# Altium project RK3568-SOM.PrjPcb (part 1 of 3)
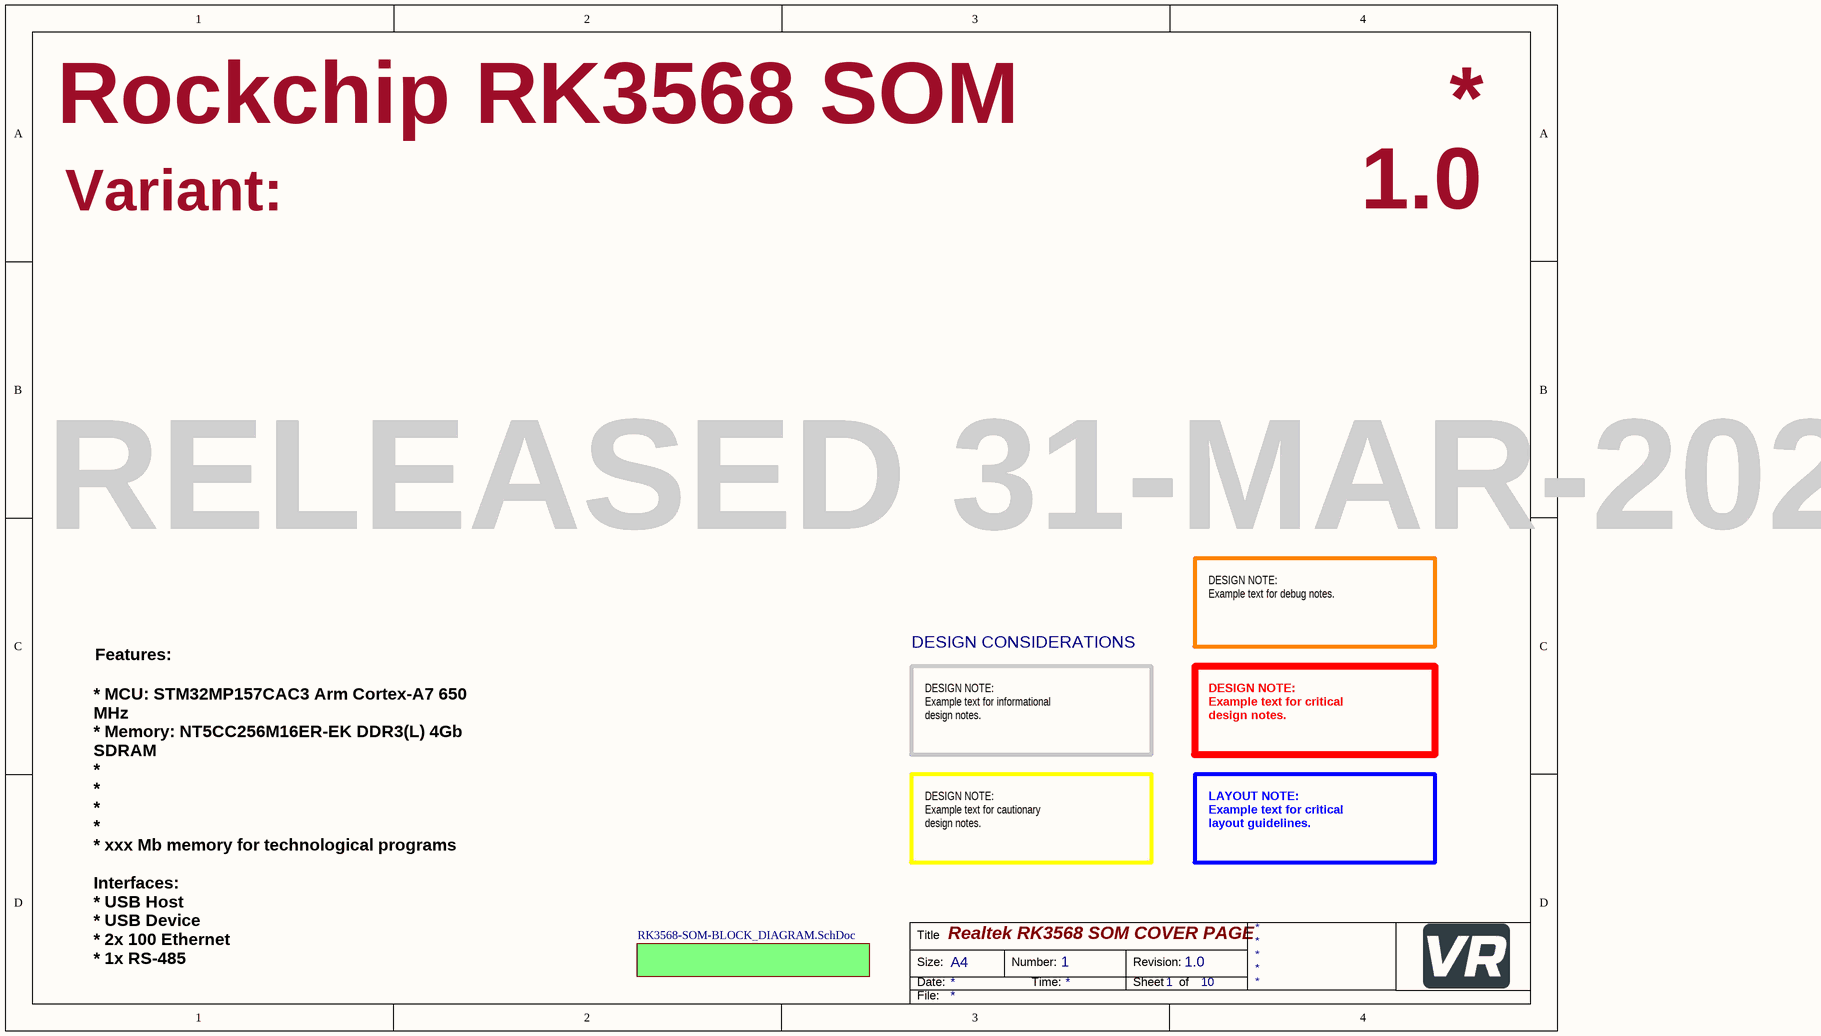
[diagram p0: RK3568-SOM-COVER.SchDoc]
Project: Rockchip RK3568 SOM; VersionRevision: 1.0
7 sheets, 489 parts. Net scope: flat (ports and power ports of the same name join across sheets).
Board file: RK3568-SOM-Board.PcbDoc
Sheets:
  RK3568-SOM-COVER.SchDoc
    Designator = RK3568-SOM-BLOCK_DIAGRAM.SchDoc
      Ethernet = RK3568-SOM-Eth.SchDoc
      Power = RK3568-SOM-PWR.SchDoc
      Memory = RK3568-SOM-DDR3_MEM.SchDoc
      EDGE CONNECTOR = RK3568-SOM-EDGE_CONNECTOR.SchDoc
      MCU = RK3568-SOM-MCU.SchDoc
      USB = RK3568-SOM-Eth.SchDoc

## Sheet RK3568-SOM-COVER.SchDoc: Realtek RK3568 SOM COVER PAGE
size A4; Author: Vladimir Tyrkin; CompanyName: VR; DocumentNumber: 1; Revision: 1.0; SheetNumber: 1; SheetTotal: 10

### Sub-sheets
Designator = RK3568-SOM-BLOCK_DIAGRAM.SchDoc: no entries

### Notes on the sheet
- Variant:
- RELEASED 31-MAR-2023
- DESIGN CONSIDERATIONS
- DESIGN NOTE:
  Example text for debug notes.
- Features:
- DESIGN NOTE:
  Example text for informational
  design notes.
- DESIGN NOTE:
  Example text for critical
  design notes.
- DESIGN NOTE:
  Example text for cautionary
  design notes.
- LAYOUT NOTE:
  Example text for critical
  layout guidelines.
- * MCU: STM32MP157CAC3 Arm Cortex-A7 650 MHz
  * Memory: NT5CC256M16ER-EK DDR3(L) 4Gb SDRAM
  *
  *
  *
  *
  * xxx Mb memory for technological programs
  Interfaces:
  * USB Host
  * USB Device
  * 2x 100 Ethernet
  * 1x RS-485
- Title
- Size:
- Date:
- A4
- Number:
- Time:
- Revision:
- Sheet
- of
- File:

## Sheet RK3568-SOM-BLOCK_DIAGRAM.SchDoc
size A1; DocumentNumber: 2; SheetNumber: 2; SheetTotal: 31; PageSetup: Record=PageOptions|CenterHorizontal=True|CenterVertical=True|PrintScale=0.52|XCorrection=1.00|YCorrection=1.00|PrintKind=1|BorderSize=5000000|LeftOffset=0|BottomOffset=0|Orientation=2|PaperLength=1000|PaperWidth=1000|Scale=100|PaperSource=4|PrintQuality=600|MediaType=1|DitherType=10|PrintScaleMode=1|PaperKind=A4|PaperIndex=9
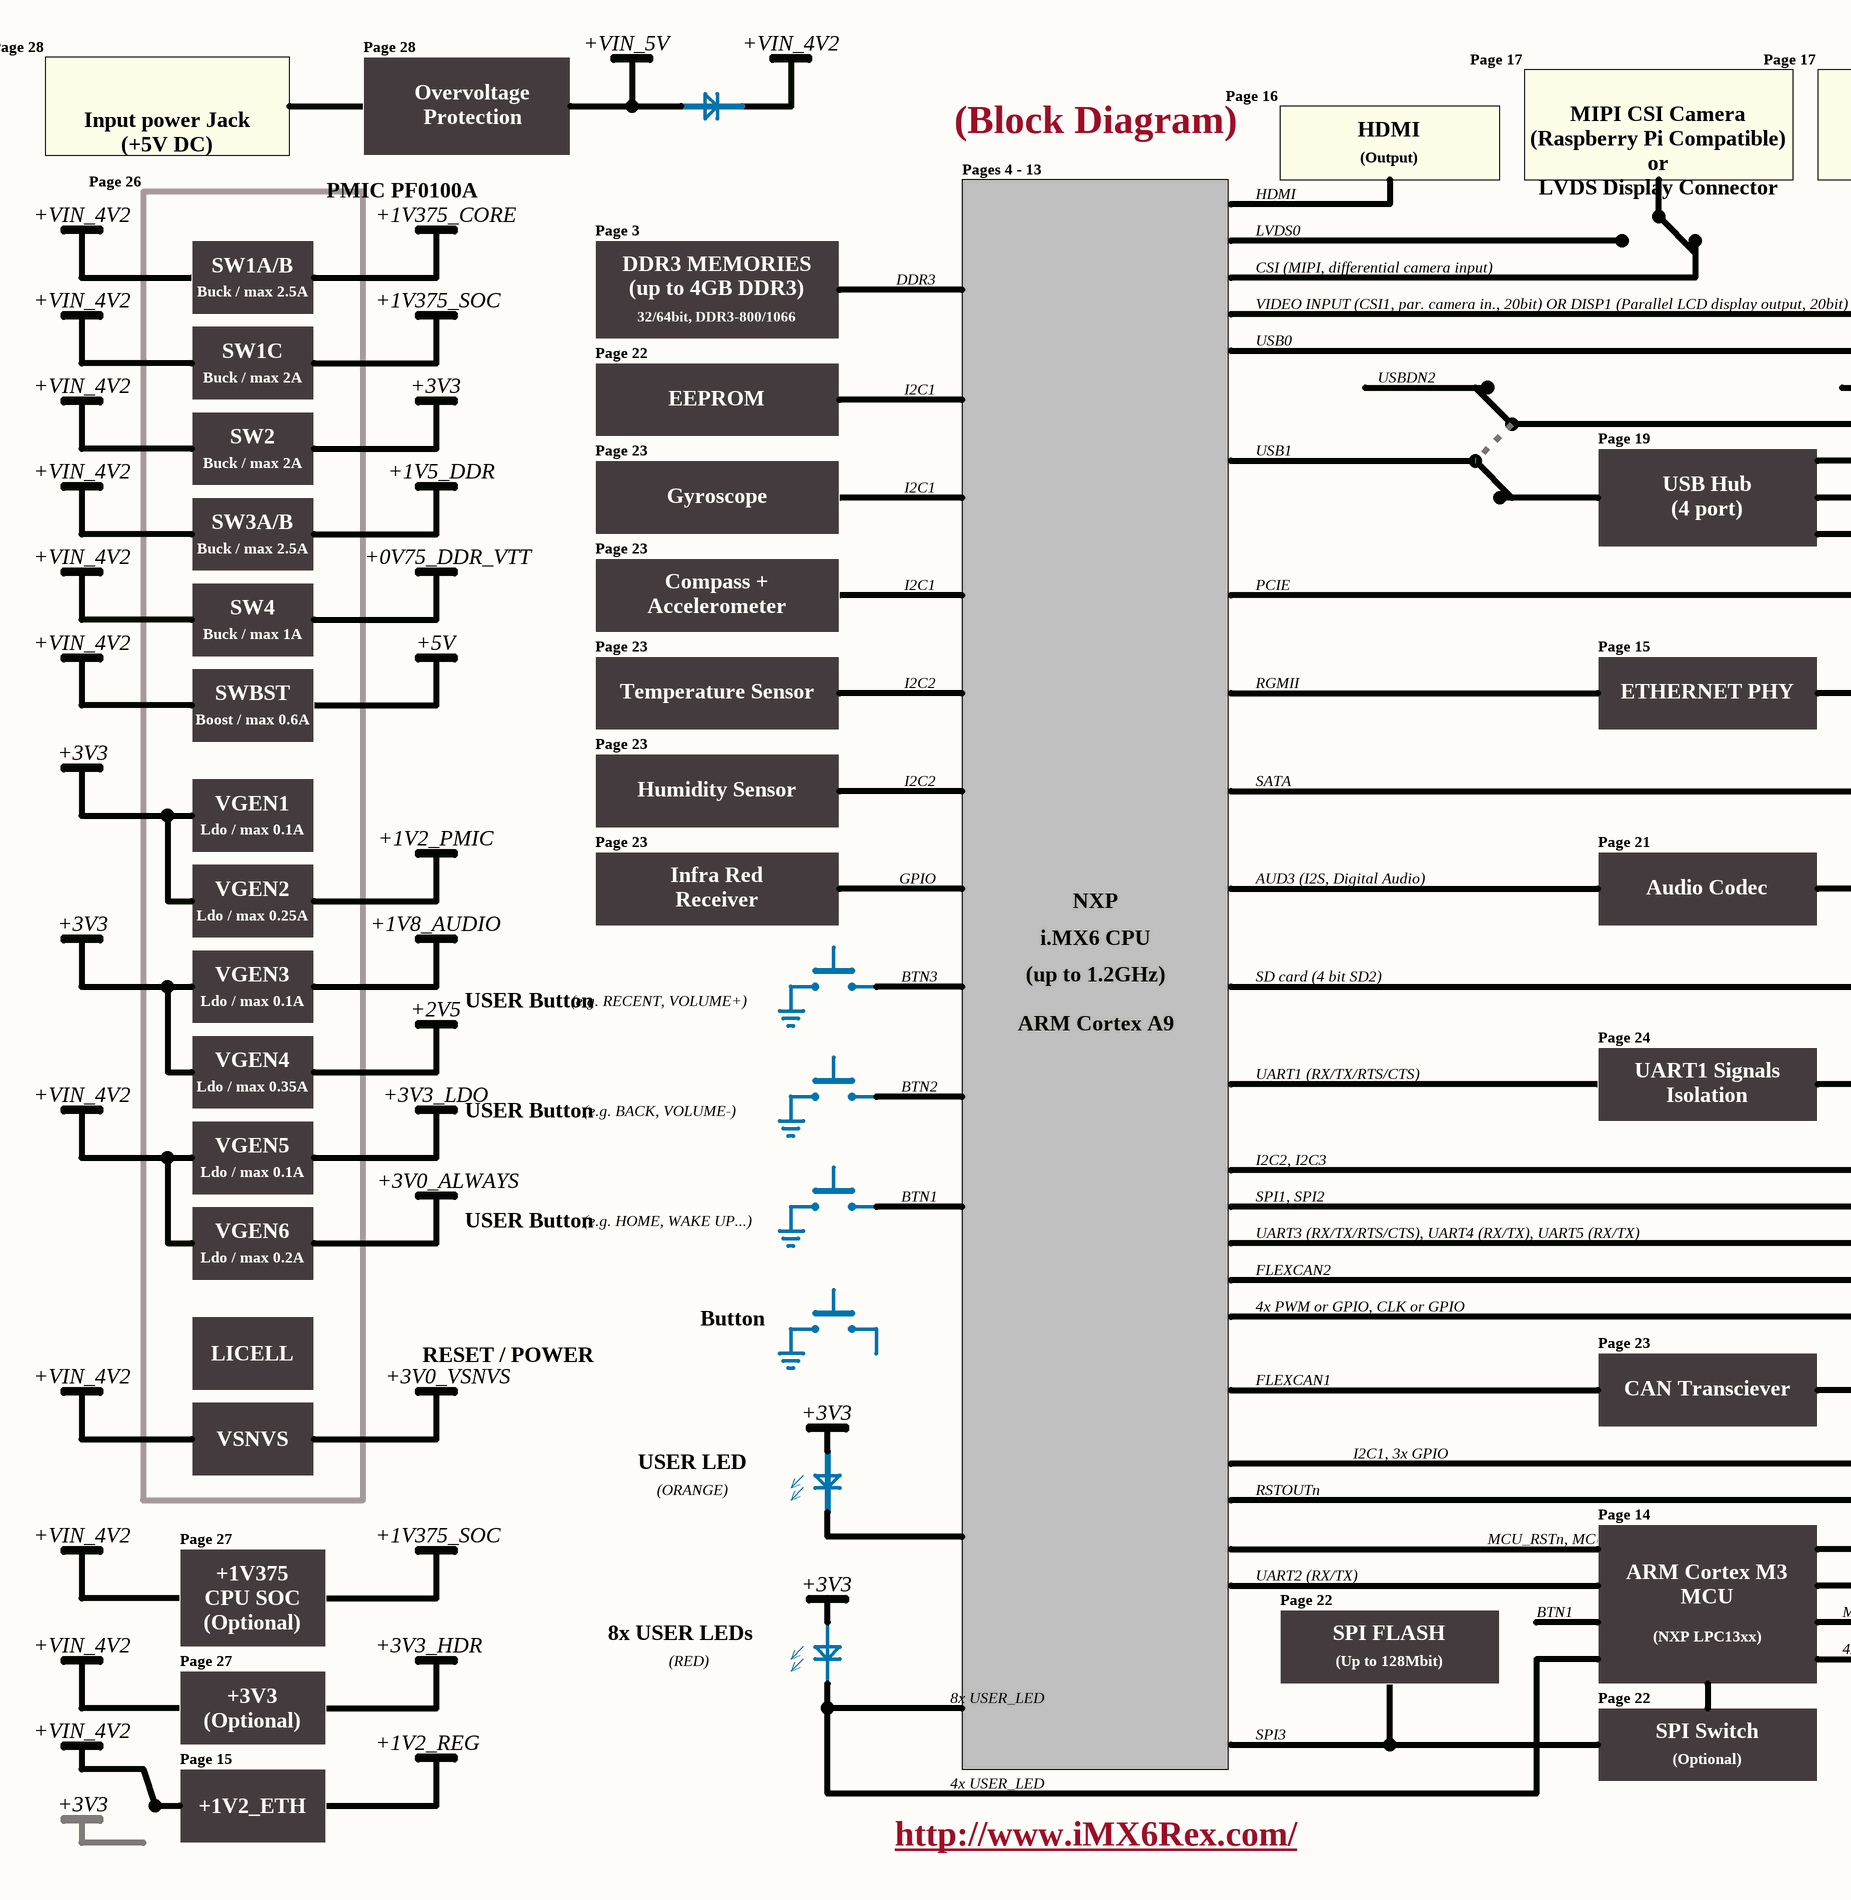
[diagram p1: RK3568-SOM-BLOCK_DIAGRAM.SchDoc, left]
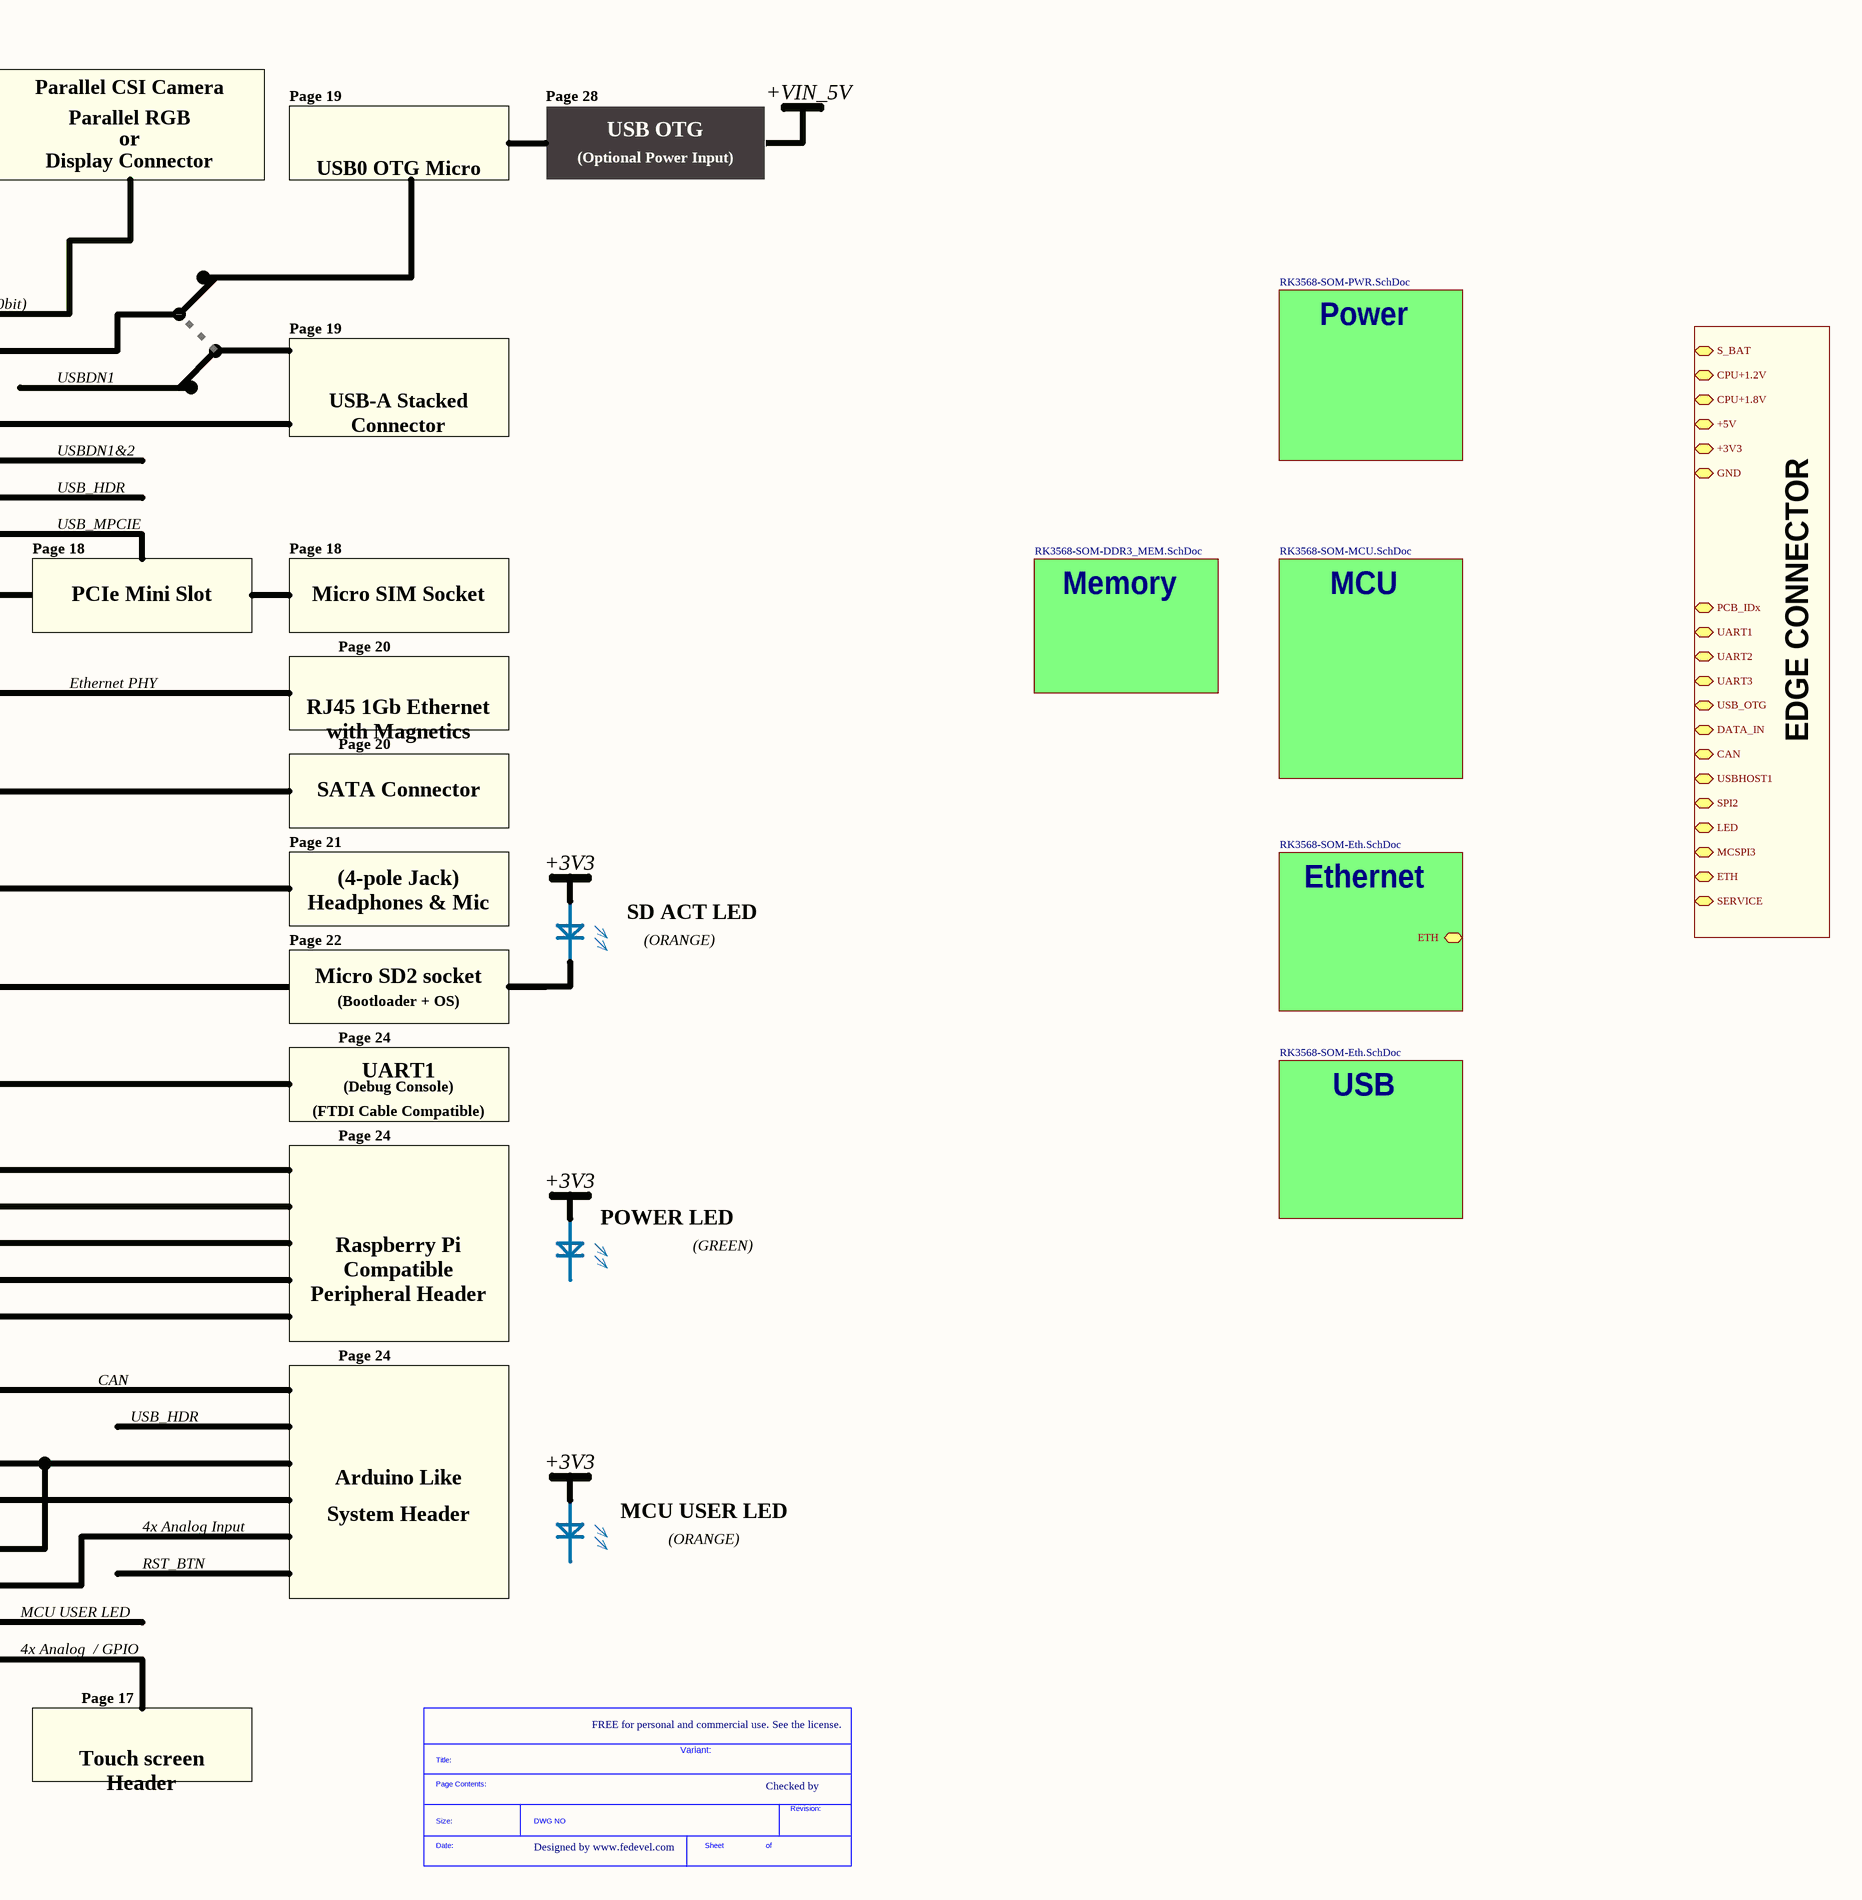
[diagram p2: RK3568-SOM-BLOCK_DIAGRAM.SchDoc, right]

### Parts
(Parts that share a designator on the sheet are numbered #1, #2 ... from top to bottom, then left to right.)
*#1  SDTitleBlock  (value not drawn)  (graphical)

### Sub-sheets
EDGE CONNECTOR = RK3568-SOM-EDGE_CONNECTOR.SchDoc: S_BAT (bidir), CPU+1.2V (bidir), GND (bidir), PCB_IDx (bidir, harness PCB_IDx), UART1 (bidir, harness UART1), UART2 (bidir, harness UART2), UART3 (bidir, harness UART3), USB_OTG (bidir, harness USB_OTG), DATA_IN (bidir, harness DATA_IN), CAN (bidir, harness CAN), USBHOST1 (bidir, harness USBHOST1), SPI2 (bidir, harness SPI2), LED (bidir, harness LED), MCSPI3 (bidir, harness MCSPI3), ETH (bidir, harness ETH), SERVICE (bidir, harness SERVICE), CPU+1.8V (bidir), +5V (bidir), +3V3 (bidir)
Ethernet = RK3568-SOM-Eth.SchDoc: ETH (bidir, harness ETH)
MCU = RK3568-SOM-MCU.SchDoc: no entries
Memory = RK3568-SOM-DDR3_MEM.SchDoc: no entries
Power = RK3568-SOM-PWR.SchDoc: no entries
USB = RK3568-SOM-Eth.SchDoc: no entries

### Notes on the sheet
- Page 28
- +VIN_5V
- +VIN_4V2
- Page 17
- MIPI CSI Camera
- Parallel CSI Camera
- Input power Jack
- (+5V DC)
- Overvoltage
- Protection
- (Block Diagram)
- Page 16
- HDMI
- (Raspberry Pi Compatible)
- or
- Parallel RGB
- Page 19
- USB0 OTG Micro
- USB OTG
- Page 26
- PMIC PF0100A
- Pages 4 - 13
- (Output)
- LVDS Display Connector
- Display Connector
- (Optional Power Input)
- SW1A/B
- +1V375_CORE
- Page 3
- DDR3 MEMORIES
- LVDS0
- CSI (MIPI, differential camera input)
- Buck / max 2.5A
- +1V375_SOC
- 32/64bit, DDR3-800/1066
- (up to 4GB DDR3)
- DDR3
- VIDEO INPUT (CSI1, par. camera in., 20bit) OR DISP1 (Parallel LCD display output, 20bit)
- SW1C
- Buck / max 2A
- +3V3
- Page 22
- I2C1
- USB0
- USBDN2
- USBDN1
- USB-A Stacked
- SW2
- Page 23
- EEPROM
- USB1
- USBDN1&2
- Connector
- SW3A/B
- +1V5_DDR
- Gyroscope
- USB Hub
- (4 port)
- USB_HDR
- +0V75_DDR_VTT
- Page 18
- USB_MPCIE
- SW4
- Buck / max 1A
- Compass +
- Accelerometer
- PCIE
- PCIe Mini Slot
- Micro SIM Socket
- SWBST
- +5V
- Temperature Sensor
- I2C2
- RGMII
- Page 15
- ETHERNET PHY
- Ethernet PHY
- Page 20
- RJ45 1Gb Ethernet
- Boost / max 0.6A
- with Magnetics
- VGEN1
- Humidity Sensor
- SATA
- SATA Connector
- Ldo / max 0.1A
- VGEN2
- +1V2_PMIC
- Infra Red
- GPIO
- AUD3 (I2S, Digital Audio)
- Page 21
- Headphones & Mic
- (4-pole Jack)
- Ldo / max 0.25A
- +1V8_AUDIO
- Receiver
- NXP
- i.MX6 CPU
- Audio Codec
- (ORANGE)
- SD ACT LED
- VGEN3
- (e.g. RECENT, VOLUME+)
- USER Button
- BTN3
- (up to 1.2GHz)
- SD card (4 bit SD2)
- Micro SD2 socket
- (Bootloader + OS)
- VGEN4
- +2V5
- ARM Cortex A9
- Page 24
- Ldo / max 0.35A
- +3V3_LDO
- (e.g. BACK, VOLUME-)
- BTN2
- UART1 (RX/TX/RTS/CTS)
- UART1 Signals
- Isolation
- UART1
- (Debug Console)
- (FTDI Cable Compatible)
- VGEN5
- +3V0_ALWAYS
- I2C2, I2C3
- VGEN6
- (e.g. HOME, WAKE UP...)
- BTN1
- SPI1, SPI2
- UART3 (RX/TX/RTS/CTS), UART4 (RX/TX), UART5 (RX/TX)
- Raspberry Pi
- Compatible
- POWER LED
- (GREEN)
- Ldo / max 0.2A
- Button
- 4x PWM or GPIO, CLK or GPIO
- FLEXCAN2
- Peripheral Header
- LICELL
- RESET / POWER
- VSNVS
- +3V0_VSNVS
- FLEXCAN1
- CAN Transciever
- CAN
- USER LED
- RSTOUTn
- I2C1, 3x GPIO
- System Header
- Arduino Like
- Page 27
- MCU_RSTn, MCU_ISPn, SWD debug
- Page 14
- 4x Analog Input
- MCU USER LED
- +1V375
- CPU SOC
- (Optional)
- UART2 (RX/TX)
- ARM Cortex M3
- MCU
- RST_BTN
- +3V3_HDR
- (RED)
- 8x USER LEDs
- SPI FLASH
- (Up to 128Mbit)
- (NXP LPC13xx)
- 4x Analog  / GPIO
- 8x USER_LED
- SPI3
- SPI Switch
- Touch screen
- FREE for personal and commercial use. See the license.
- +1V2_ETH
- +1V2_REG
- 4x USER_LED
- Header
- Variant:
- Checked by
- http://www.iMX6Rex.com/
- Designed by www.fedevel.com
- (in symbol SDTitleBlock) Title:; Page Contents:; Revision:; Size:; DWG NO; Date:; Sheet; of

## Sheet RK3568-SOM-Eth.SchDoc: Ethernet PHY with RJ45 connector
size A2; Date: Not used; ApprovedBy: Not used; CheckedBy: Not used; Author: Not used; CompanyName: STMicroelectronics; DrawnBy: Not used; Engineer: Not used; Organization: Not used; Address1: Not used; Address2: Not used; Address3: Not used; Address4: Not used; DocumentNumber: 6; Revision: Not used; SheetNumber: 6; SheetTotal: 9; Time: Not used; ImagePath: Not used; Application_BuildNumber: Not used
Used 2 times, as channels Designator/Ethernet, Designator/USB. Parts and nets are listed once, with the designators drawn on the sheet.
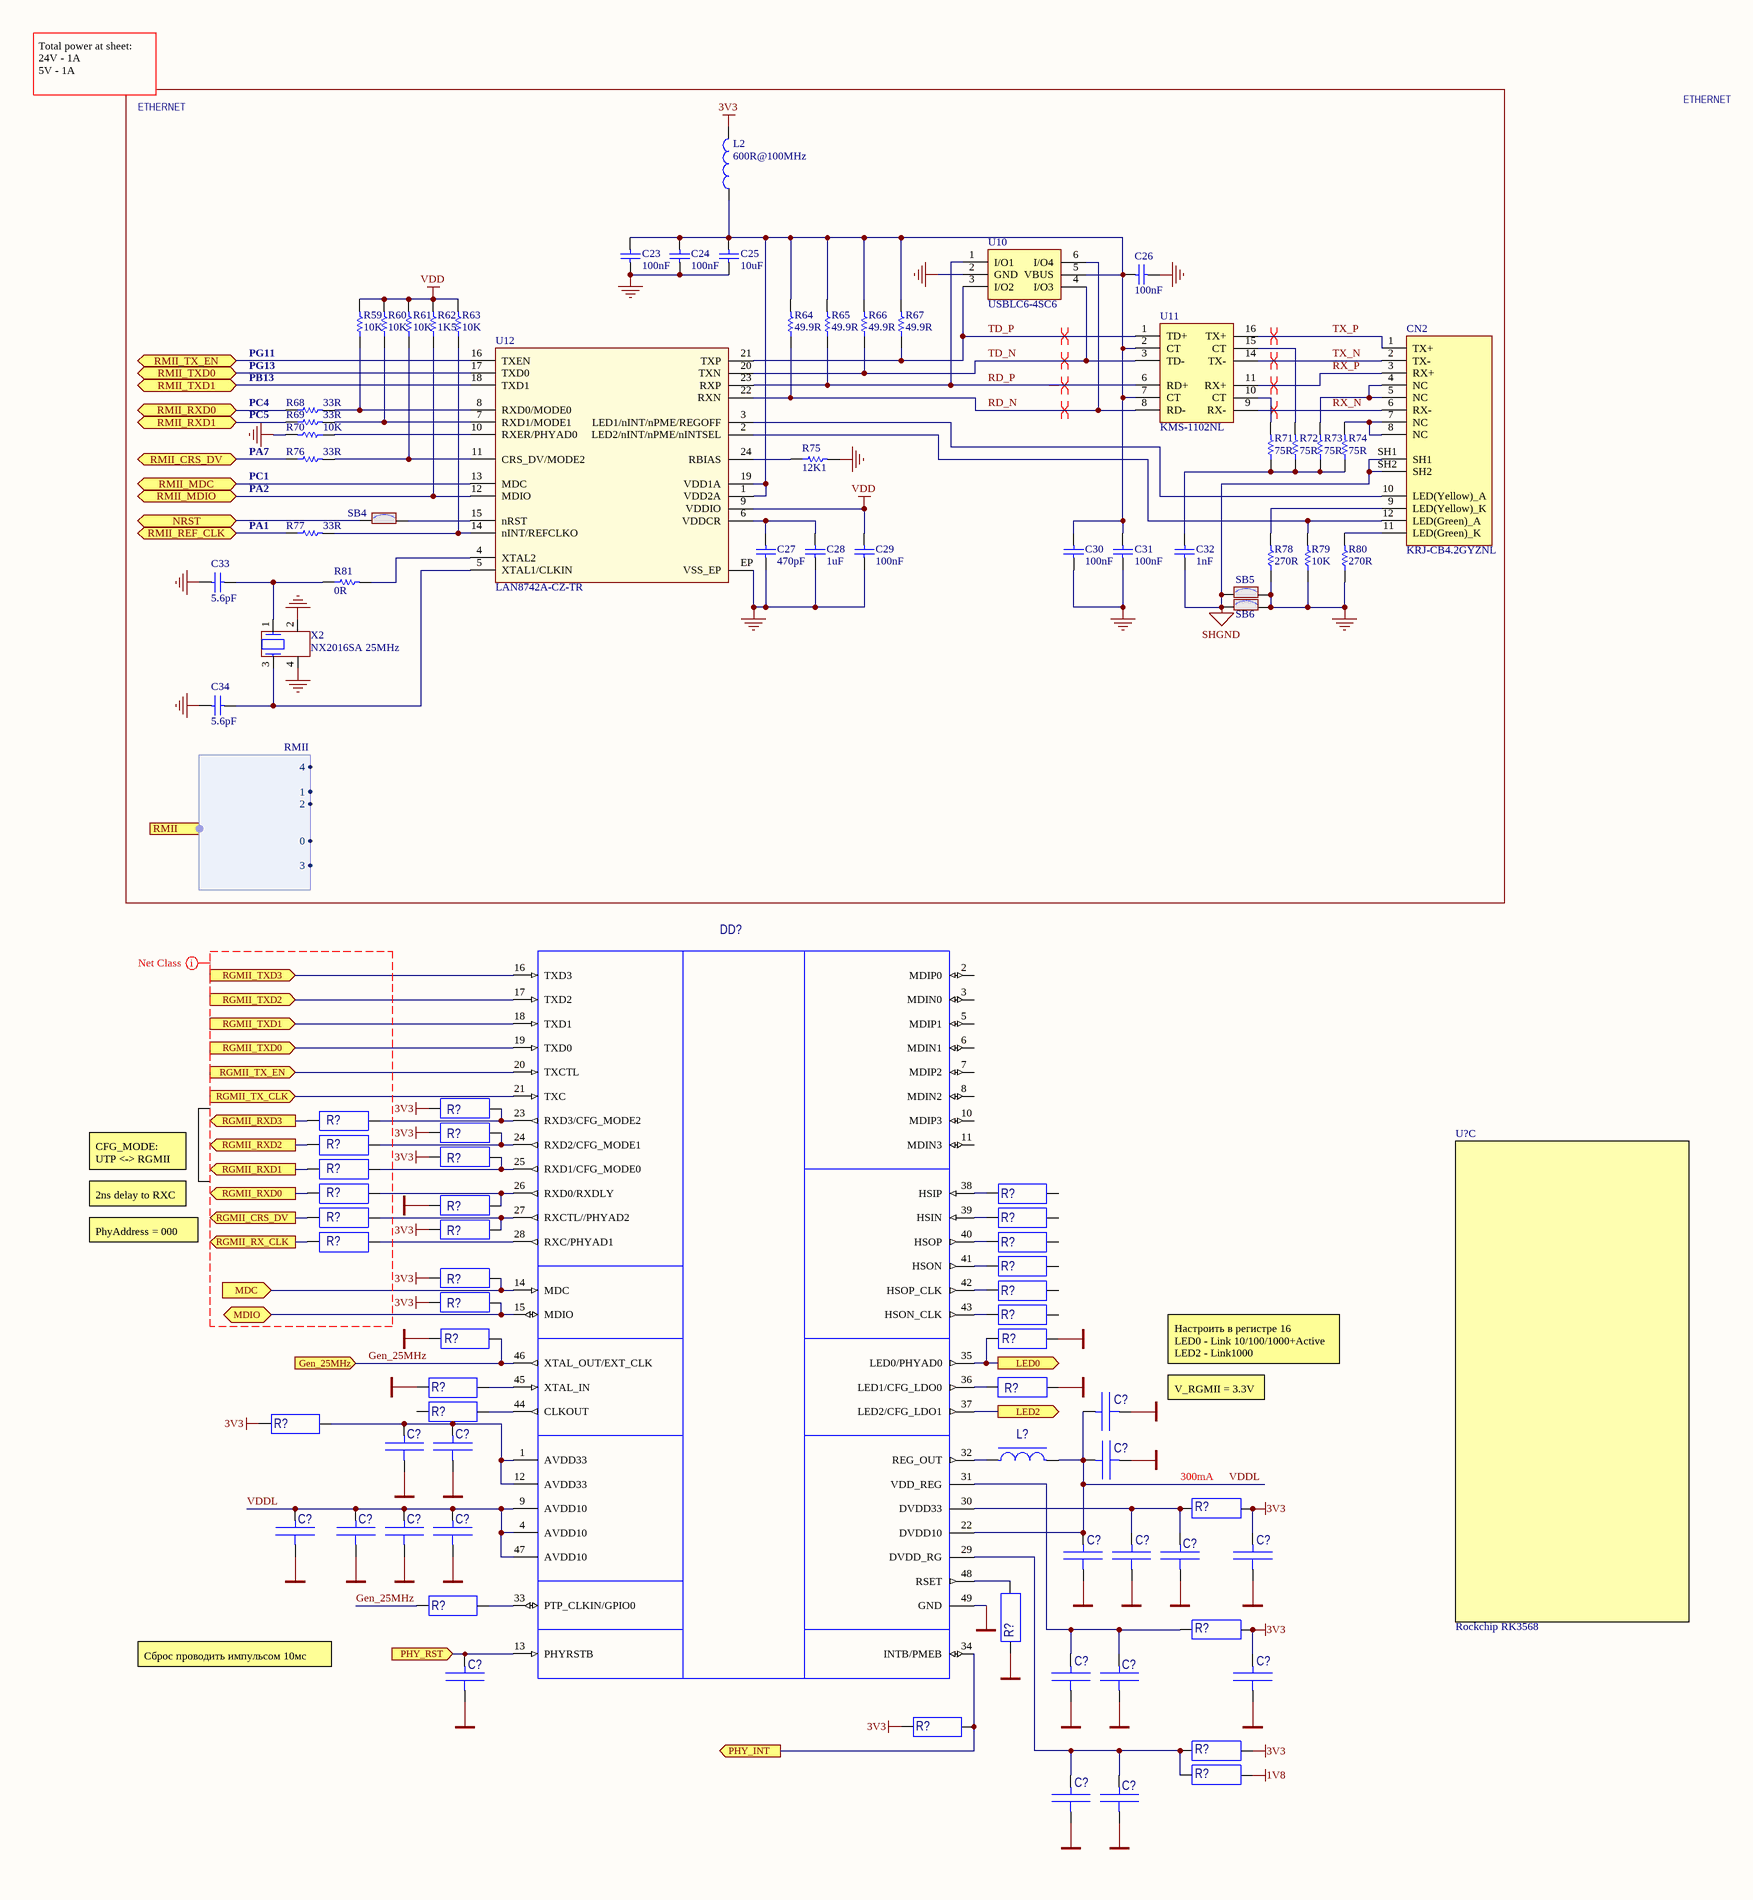
[diagram p3: RK3568-SOM-Eth.SchDoc, left]
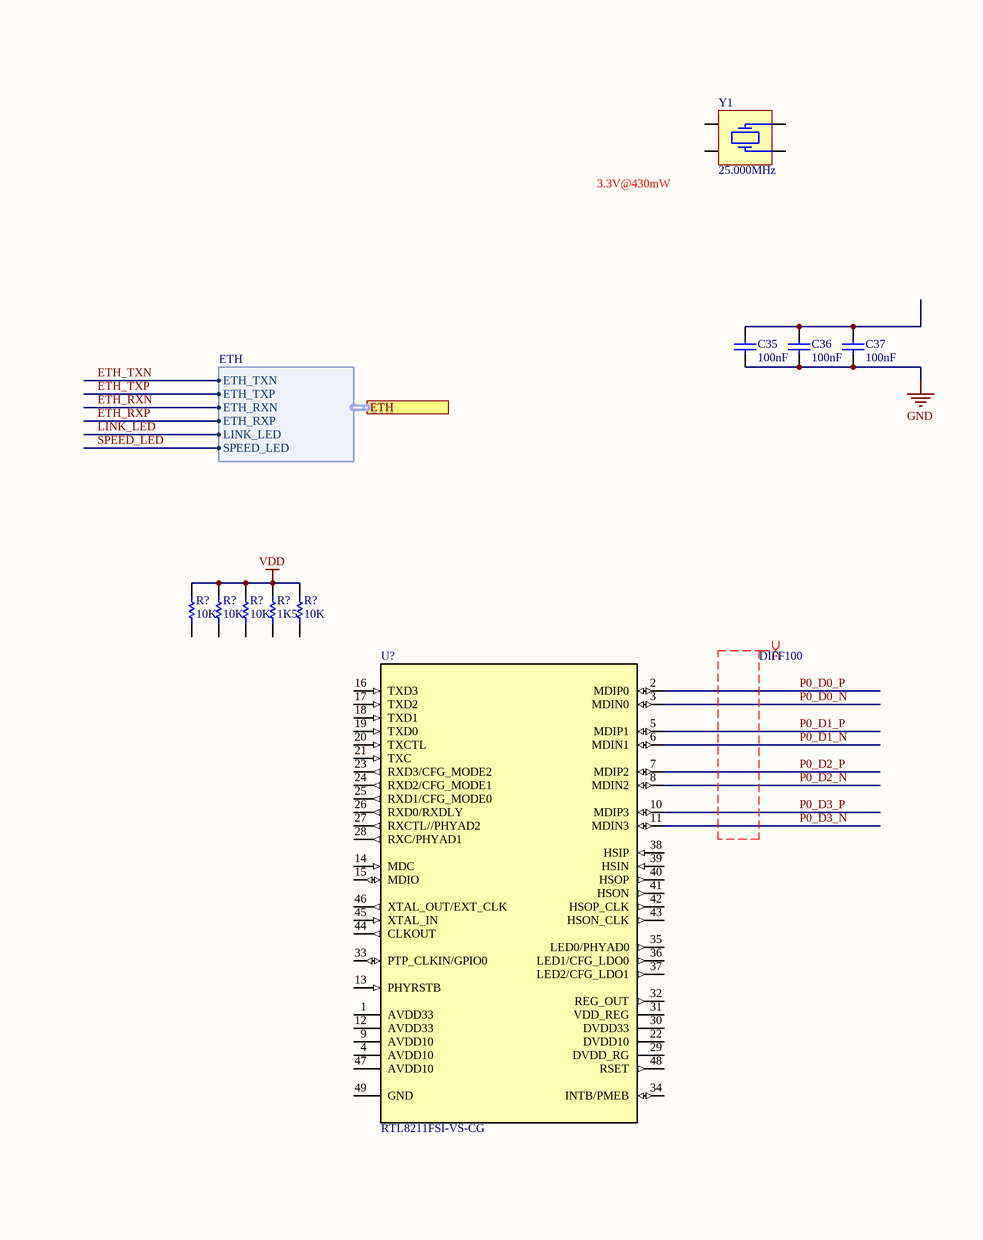
[diagram p4: RK3568-SOM-Eth.SchDoc, right]

### Parts
(Parts that share a designator on the sheet are numbered #1, #2 ... from top to bottom, then left to right.)
C23  value 100nF  [C0603]  (hidden comment: Capacitor)
C24  value 100nF  [C0603]  (hidden comment: Capacitor)
C25  value 10uF  [C0603]  (hidden comment: Capacitor)
C26  value 100nF  [C0603]  (hidden comment: Capacitor)
C27  value 470pF  [C0402]  (hidden comment: Capacitor)
C28  value 1uF  [C0402]  (hidden comment: Capacitor)
C29  value 100nF  [C0603]  (hidden comment: Capacitor)
C30  value 100nF  [C0603]  (hidden comment: Capacitor)
C31  value 100nF  [C0603]  (hidden comment: Capacitor)
C32  value 1nF  [C1206_H1P6]  (hidden comment: Capacitor)
C33  value 5.6pF  [C0402]  (hidden comment: Capacitor)
C34  value 5.6pF  [C0402]  (hidden comment: Capacitor)
C35  value 100nF  [C0603]  (hidden comment: Capacitor)
C36  value 100nF  [C0603]  (hidden comment: Capacitor)
C37  value 100nF  [C0603]  (hidden comment: Capacitor)
C?#1  C0805-16В-4,7мкФ-10%-X7R (CCTC, TCC0805X7R475K160FT)  [CC0805-KL]  (value not drawn)
C?#2  C0402-16В-0,1мкФ-10%-X7R (CCTC, TCC0402X7R104K160AT)  [C0402]  (value not drawn)
C?#3  C0402-16В-0,1мкФ-10%-X7R (CCTC, TCC0402X7R104K160AT)  [C0402]  (value not drawn)
C?#4  C0402-16В-0,1мкФ-10%-X7R (CCTC, TCC0402X7R104K160AT)  [C0402]  (value not drawn)
C?#5  C0603-25В-1,0мкФ-10%-X7R (CCTC, TCC0603X7R105K250CT)  [CC0603-KL]  (value not drawn)
C?#6  C0402-16В-0,1мкФ-10%-X7R (CCTC, TCC0402X7R104K160AT)  [C0402]  (value not drawn)
C?#7  C0402-16В-0,1мкФ-10%-X7R (CCTC, TCC0402X7R104K160AT)  [C0402]  (value not drawn)
C?#8  C0402-16В-0,1мкФ-10%-X7R (CCTC, TCC0402X7R104K160AT)  [C0402]  (value not drawn)
C?#9  C0402-16В-0,1мкФ-10%-X7R (CCTC, TCC0402X7R104K160AT)  [C0402]  (value not drawn)
C?#10  C0402-16В-0,1мкФ-10%-X7R (CCTC, TCC0402X7R104K160AT)  [C0402]  (value not drawn)
C?#11  C0603-25В-1,0мкФ-10%-X7R (CCTC, TCC0603X7R105K250CT)  [CC0603-KL]  (value not drawn)
C?#12  C0402-16В-0,1мкФ-10%-X7R (CCTC, TCC0402X7R104K160AT)  [C0402]  (value not drawn)
C?#13  C0402-16В-0,1мкФ-10%-X7R (CCTC, TCC0402X7R104K160AT)  [C0402]  (value not drawn)
C?#14  C0402-16В-0,1мкФ-10%-X7R (CCTC, TCC0402X7R104K160AT)  [C0402]  (value not drawn)
C?#15  C0603-25В-1,0мкФ-10%-X7R (CCTC, TCC0603X7R105K250CT)  [CC0603-KL]  (value not drawn)
C?#16  C0402-16В-0,1мкФ-10%-X7R (CCTC, TCC0402X7R104K160AT)  [C0402]  (value not drawn)
C?#17  C0402-16В-0,1мкФ-10%-X7R (CCTC, TCC0402X7R104K160AT)  [C0402]  (value not drawn)
C?#18  C0603-25В-1,0мкФ-10%-X7R (CCTC, TCC0603X7R105K250CT)  [CC0603-KL]  (value not drawn)
CN2  value KRJ-CB4.2GYZNL  [CON_RJ45_DGKYD_KRJ-CB4.2GYZNL]  (hidden comment: RJ45_KRJ-CB4.2GYZNL)
DD?  RTL8211FSI-VS-CG (REALTEK, QFN-48)  [QFN40P600X600X100-with_vias]  (value not drawn)
L2  value 600R@100MHz  [L0603]  (hidden comment: BEAD)
L?  L1210-2,2мкГн-20%-3,6А-75мОм (3Lcoils, LHP322512-2R2M)  [IND3225X135]  (value not drawn)
R59  value 10K  [R0402]  (hidden comment: Resistor)
R60  value 10K  [R0402]  (hidden comment: Resistor)
R61  value 10K  [R0402]  (hidden comment: Resistor)
R62  value 1K5  [R0402]  (hidden comment: Resistor)
R63  value 10K  [R0402]  (hidden comment: Resistor)
R64  value 49.9R  [R0402]  (hidden comment: Resistor)
R65  value 49.9R  [R0402]  (hidden comment: Resistor)
R66  value 49.9R  [R0402]  (hidden comment: Resistor)
R67  value 49.9R  [R0402]  (hidden comment: Resistor)
R68  value 33R  [R0402]  (hidden comment: Resistor)
R69  value 33R  [R0402]  (hidden comment: Resistor)
R70  value 10K  [R0402]  (hidden comment: Resistor)
R71  value 75R  [R0402]  (hidden comment: Resistor)
R72  value 75R  [R0402]  (hidden comment: Resistor)
R73  value 75R  [R0402]  (hidden comment: Resistor)
R74  value 75R  [R0402]  (hidden comment: Resistor)
R75  value 12K1  [R0402]  (hidden comment: Resistor)
R76  value 33R  [R0402]  (hidden comment: Resistor)
R77  value 33R  [R0402]  (hidden comment: Resistor)
R78  value 270R  [R0402]  (hidden comment: Resistor)
R79  value 10K  [R0402]  (hidden comment: Resistor)
R80  value 270R  [R0402]  (hidden comment: Resistor)
R81  value 0R  [R0402]  (hidden comment: Resistor)
R?#1  (no value)  [R0402]
R?#2  RC02-22 Ом-1%  [R0402]  (value not drawn)
R?#3  value 10K  [R0402]  (hidden comment: Resistor)
R?#4  value 10K  [R0402]  (hidden comment: Resistor)
R?#5  value 10K  [R0402]  (hidden comment: Resistor)
R?#6  value 1K5  [R0402]  (hidden comment: Resistor)
R?#7  value 10K  [R0402]  (hidden comment: Resistor)
R?#8  (no value)  [R0402]
R?#9  RC02-22 Ом-1%  [R0402]  (value not drawn)
R?#10  (no value)  [R0402]
R?#11  RC02-22 Ом-1%  [R0402]  (value not drawn)
R?#12  RC02-22 Ом-1%  [R0402]  (value not drawn)
R?#13  RC02-0,0 Ом 5%  [R0402]  (value not drawn)
R?#14  (no value)  [R0402]
R?#15  RC02-22 Ом-1%  [R0402]  (value not drawn)
R?#16  RC02-0,0 Ом 5%  [R0402]  (value not drawn)
R?#17  (no value)  [R0402]
R?#18  RC02-22 Ом-1%  [R0402]  (value not drawn)
R?#19  RC02-0,0 Ом 5%  [R0402]  (value not drawn)
R?#20  RC02-0,0 Ом 5%  [R0402]  (value not drawn)
R?#21  RC02-2,0кОм 5%  [R0402]  (value not drawn)
R?#22  RC02-0,0 Ом 5%  [R0402]  (value not drawn)
R?#23  RC02-2,0кОм 5%  [R0402]  (value not drawn)
R?#24  RC02-0,0 Ом 5%  [R0402]  (value not drawn)
R?#25  RC02-4,7кОм 5%  [R0402]  (value not drawn)
R?#26  RC02-4,7кОм 5%  [R0402]  (value not drawn)
R?#27  RC02-0,0 Ом 5%  [R0402]  (value not drawn)
R?#28  RC02-2,0кОм 5%  [R0402]  (value not drawn)
R?#29  (no value)  [R0402]
R?#30  RC02-0,0 Ом 5%  [R0402]  (value not drawn)
R?#31  RC02-0,0 Ом 5%  [R0402]  (value not drawn)
R?#32  (no value)  [R0402]
R?#33  RC02-0,0 Ом 5%  [R0402]  (value not drawn)
R?#34  RC03-2,49кОм 1% (Walsin, WR06X2491FTL)  [RC0603-KL]  (value not drawn)
R?#35  RC02-4,7кОм 5%  [R0402]  (value not drawn)
R?#36  RC02-0,0 Ом 5%  [R0402]  (value not drawn)
R?#37  (no value)  [R0402]
SB4  SB_ON  [SOLDER-BRIDGE_R0603-0R]  (value not drawn)
SB5  SB_ON  [SOLDER-BRIDGE_R0603-0R]  (value not drawn)
SB6  SB_ON  [SOLDER-BRIDGE_R0603-0R]  (value not drawn)
U10  USBLC6-4SC6  [ESD_SOT23-6L]
U11  KMS-1102NL  [TRS_DGKYD_KMS-1102NL]
U12  LAN8742A-CZ-TR  [ICC_VQFN24-EPAD_4X4_P050]
U?#1  PartNumber: RTL8211FSI-VS-CG  [QFN40P600X600X100-with_vias]  (hidden comment: RTL8211FSI-VS-CG (REALTEK, QFN-48))
U?#2  PartNumber: Rockchip RK3568  [ESQ-120-14-G-D]  (hidden comment: *)  (part C of 6)
X2  value NX2016SA 25MHz  [CRY_NX2016SA_4P]  (hidden comment: XTAL_4_PINS)
Y1  25.000MHz  [ABM8G]

### Ports
ETH (harness ETH), Gen_25MHz (in), LED0 (out), LED2 (out), MDC (in), MDIO (bidir), NRST (bidir), PHY_INT (out), PHY_RST (in), RGMII_CRS_DV (out), RGMII_RX_CLK (out), RGMII_RXD0 (out), RGMII_RXD1 (out), RGMII_RXD2 (out), RGMII_RXD3 (out), RGMII_TX_CLK (in), RGMII_TX_EN (in), RGMII_TXD0 (in), RGMII_TXD1 (in), RGMII_TXD2 (in), RGMII_TXD3 (in), RMII (harness RMII), RMII_CRS_DV (bidir), RMII_MDC (bidir), RMII_MDIO (bidir), RMII_REF_CLK (bidir), RMII_RXD0 (bidir), RMII_RXD1 (bidir), RMII_TX_EN (bidir), RMII_TXD0 (bidir), RMII_TXD1 (bidir)

### Harnesses
RMII: 0, 1, 2, 3, 4
ETH: ETH_TXN, ETH_TXP, ETH_RXN, ETH_RXP, LINK_LED, SPEED_LED

### Nets
1V8: R?#37.2
3V3: C?#12.1 C?#16.1 L2.2 R?#1.1 R?#8.1 R?#10.1 R?#17.1 R?#21.1 R?#23.1 R?#30.2 R?#31.2 R?#33.2 R?#35.2 R?#36.2
GND: C23.1 C24.1 C25.1 C26.2 C27.1 C28.1 C29.1 C30.1 C31.1 C33.1 C34.1 C35.1 C36.1 C37.1 C?#1.2 C?#2.2 C?#3.2 C?#4.2 C?#5.2 C?#6.2 C?#7.2 C?#8.2 C?#9.2 C?#10.2 C?#11.2 C?#12.2 C?#13.2 C?#14.2 C?#15.2 C?#16.2 C?#17.2 C?#18.2 DD?.49(GND) R70.2 R75.2 R78.1 R79.1 R80.1 R?#14.1 R?#25.1 R?#26.2 R?#27.2 R?#28.2 R?#34.1 SB5.2 SB6.2 U10.2(GND) U12.EP(VSS_EP) X2.2 X2.4
SHGND: C32.1 CN2.SH1 CN2.SH2 SB5.1 SB6.1
VDD: C29.2 R59.2 R60.2 R61.2 R62.2 R63.2 R?#3.2 R?#4.2 R?#5.2 R?#6.2 R?#7.2 U12.9(VDDIO)
ETH_RXN: port ETH.ETH_RXN
ETH_RXP: port ETH.ETH_RXP
ETH_TXN: port ETH.ETH_TXN
ETH_TXP: port ETH.ETH_TXP
Gen_25MHz: DD?.46(XTAL_OUT/EXT_CLK) R?#25.2 R?#32.2 ; port Gen_25MHz
LED0: DD?.35(LED0/PHYAD0) R?#26.1 ; port LED0
LED2: DD?.37(LED2/CFG_LDO1) ; port LED2
LINK_LED: port ETH.LINK_LED
MDC: DD?.14(MDC) R?#21.2 ; port MDC
MDIO: DD?.15(MDIO) R?#23.2 ; port MDIO
NRST: SB4.1 ; port NRST
P0_D0_N: U?#1.3(MDIN0)
P0_D0_P: U?#1.2(MDIP0)
P0_D1_N: U?#1.6(MDIN1)
P0_D1_P: U?#1.5(MDIP1)
P0_D2_N: U?#1.8(MDIN2)
P0_D2_P: U?#1.7(MDIP2)
P0_D3_N: U?#1.11(MDIN3)
P0_D3_P: U?#1.10(MDIP3)
PHY_INT: DD?.34(INTB/PMEB) R?#35.1 ; port PHY_INT
PHY_RST: C?#13.1 DD?.13(PHYRSTB) ; port PHY_RST
RD_N: R64.1 U10.6(I/O4) U11.8(RD-) U12.22(RXN)
RD_P: R65.1 U10.1(I/O1) U11.6(RD+) U12.23(RXP)
RGMII_CRS_DV: R?#15.2 ; port RGMII_CRS_DV
RGMII_RX_CLK: R?#18.2 ; port RGMII_RX_CLK
RGMII_RXD0: R?#12.2 ; port RGMII_RXD0
RGMII_RXD1: R?#11.2 ; port RGMII_RXD1
RGMII_RXD2: R?#9.2 ; port RGMII_RXD2
RGMII_RXD3: R?#2.2 ; port RGMII_RXD3
RGMII_TX_CLK: DD?.21(TXC) ; port RGMII_TX_CLK
RGMII_TX_EN: DD?.20(TXCTL) ; port RGMII_TX_EN
RGMII_TXD0: DD?.19(TXD0) ; port RGMII_TXD0
RGMII_TXD1: DD?.18(TXD1) ; port RGMII_TXD1
RGMII_TXD2: DD?.17(TXD2) ; port RGMII_TXD2
RGMII_TXD3: DD?.16(TXD3) ; port RGMII_TXD3
RMII_CRS_DV: R76.1 ; port RMII_CRS_DV
RMII_MDC: U12.13(MDC) ; port RMII_MDC
RMII_MDIO: R62.1 U12.12(MDIO) ; port RMII_MDIO
RMII_REF_CLK: R77.1 ; port RMII_REF_CLK
RMII_RXD0: R68.1 ; port RMII_RXD0
RMII_RXD1: R69.1 ; port RMII_RXD1
RMII_TX_EN: U12.16(TXEN) ; port RMII_TX_EN
RMII_TXD0: U12.17(TXD0) ; port RMII_TXD0
RMII_TXD1: U12.18(TXD1) ; port RMII_TXD1
RX_N: CN2.6(RX-) U11.9(RX-)
RX_P: CN2.3(RX+) U11.11(RX+)
SPEED_LED: port ETH.SPEED_LED
TD_N: R66.1 U10.4(I/O3) U11.3(TD-) U12.20(TXN)
TD_P: R67.1 U10.3(I/O2) U11.1(TD+) U12.21(TXP)
TX_N: CN2.2(TX-) U11.14(TX-)
TX_P: CN2.1(TX+) U11.16(TX+)
VDDL: C?#1.1 C?#4.1 C?#5.1 C?#6.1 C?#7.1 C?#8.1 C?#9.1 DD?.4(AVDD10) DD?.9(AVDD10) DD?.22(DVDD10) DD?.47(AVDD10) L?.2
NetC23_2: C23.2 C24.2 C25.2 C26.1 C30.2 C31.2 L2.1 R64.2 R65.2 R66.2 R67.2 U10.5(VBUS) U11.2(CT) U11.7(CT) U12.1(VDD2A) U12.19(VDD1A)
NetC27_2: C27.2 C28.2 U12.6(VDDCR)
NetC32_2: C32.2 R71.1 R72.1 R73.1 R74.1
NetC33_2: C33.2 R81.1 X2.1
NetC34_2: C34.2 U12.5(XTAL1/CLKIN) X2.3
NetC35_2: C35.2 C36.2 C37.2
NetC?#2_1: C?#2.1 C?#3.1 DD?.1(AVDD33) DD?.12(AVDD33) R?#30.1
NetC?#10_1: C?#10.1 C?#11.1 DD?.30(DVDD33) R?#31.1
NetC?#14_1: C?#14.1 C?#15.1 DD?.31(VDD_REG) R?#33.1
NetC?#17_1: C?#17.1 C?#18.1 DD?.29(DVDD_RG) R?#36.1 R?#37.1
NetCN2_4: CN2.4(NC) CN2.5(NC) R73.2
NetCN2_7: CN2.7(NC) CN2.8(NC) R74.2
NetCN2_9: CN2.9(LED(Yellow)_K) R78.2
NetCN2_10: CN2.10(LED(Yellow)_A) U12.3(LED1/nINT/nPME/REGOFF)
NetCN2_11: CN2.11(LED(Green)_K) R80.2
NetCN2_12: CN2.12(LED(Green)_A) R79.2 U12.2(LED2/nINT/nPME/nINTSEL)
NetDD?_23: DD?.23(RXD3/CFG_MODE2) R?#1.2 R?#2.1
NetDD?_24: DD?.24(RXD2/CFG_MODE1) R?#8.2 R?#9.1
NetDD?_25: DD?.25(RXD1/CFG_MODE0) R?#10.2 R?#11.1
NetDD?_26: DD?.26(RXD0/RXDLY) R?#12.1 R?#14.2
NetDD?_27: DD?.27(RXCTL//PHYAD2) R?#15.1 R?#17.2
NetDD?_28: DD?.28(RXC/PHYAD1) R?#18.1
NetDD?_32: DD?.32(REG_OUT) L?.1
NetDD?_33: DD?.33(PTP_CLKIN/GPIO0) R?#32.1
NetDD?_36: DD?.36(LED1/CFG_LDO0) R?#28.1
NetDD?_38: DD?.38(HSIP) R?#13.2
NetDD?_39: DD?.39(HSIN) R?#16.2
NetDD?_40: DD?.40(HSOP) R?#19.2
NetDD?_41: DD?.41(HSON) R?#20.2
NetDD?_42: DD?.42(HSOP_CLK) R?#22.2
NetDD?_43: DD?.43(HSON_CLK) R?#24.2
NetDD?_44: DD?.44(CLKOUT) R?#29.1
NetDD?_45: DD?.45(XTAL_IN) R?#27.1
NetDD?_48: DD?.48(RSET) R?#34.2
NetR59_1: R59.1 R68.2 U12.8(RXD0/MODE0)
NetR60_1: R60.1 R69.2 U12.7(RXD1/MODE1)
NetR61_1: R61.1 R76.2 U12.11(CRS_DV/MODE2)
NetR63_1: R63.1 R77.2 U12.14(nINT/REFCLKO)
NetR70_1: R70.1 U12.10(RXER/PHYAD0)
NetR71_2: R71.2 U11.10(CT)
NetR72_2: R72.2 U11.15(CT)
NetR75_1: R75.1 U12.24(RBIAS)
NetR81_2: R81.2 U12.4(XTAL2)
NetSB4_2: SB4.2 U12.15(nRST)

Not connected (* = marked no-connect by the designer): DD? 2(MDIP0) 3(MDIN0) 5(MDIP1) 6(MDIN1) 7(MDIP2) 8(MDIN2) 10(MDIP3) 11(MDIN3); R?#3 1; R?#4 1; R?#5 1; R?#6 1; R?#7 1; R?#13 1; R?#16 1; R?#19 1; R?#20 1; R?#22 1; R?#24 1; R?#29 2; U?#1 1(AVDD33) 4(AVDD10) 9(AVDD10) 12(AVDD33) 13(PHYRSTB) 14(MDC) 15(MDIO) 16(TXD3) 17(TXD2) 18(TXD1) 19(TXD0) 20(TXCTL) 21(TXC) 22(DVDD10) 23(RXD3/CFG_MODE2) 24(RXD2/CFG_MODE1) 25(RXD1/CFG_MODE0) 26(RXD0/RXDLY) 27(RXCTL//PHYAD2) 28(RXC/PHYAD1) 29(DVDD_RG) 30(DVDD33) 31(VDD_REG) 32(REG_OUT) 33(PTP_CLKIN/GPIO0) 34(INTB/PMEB) 35(LED0/PHYAD0) 36(LED1/CFG_LDO0) 37(LED2/CFG_LDO1) 38(HSIP) 39(HSIN) 40(HSOP) 41(HSON) 42(HSOP_CLK) 43(HSON_CLK) 44(CLKOUT) 45(XTAL_IN) 46(XTAL_OUT/EXT_CLK) 47(AVDD10) 48(RSET) 49(GND); Y1 1 2 3 4

### Channels
Designator/Ethernet: designators C23=C23_Ethernet C24=C24_Ethernet C25=C25_Ethernet C26=C26_Ethernet C27=C27_Ethernet C28=C28_Ethernet C29=C29_Ethernet C30=C30_Ethernet C31=C31_Ethernet C32=C32_Ethernet C33=C33_Ethernet C34=C34_Ethernet C35=C35_Ethernet C36=C36_Ethernet C37=C37_Ethernet C?=C?_Ethernet#1 C?=C?_Ethernet#4 C?=C?_Ethernet#9 C?=C?_Ethernet#6 C?=C?_Ethernet#7 C?=C?_Ethernet#8 C?=C?_Ethernet#5 C?=C?_Ethernet#2 C?=C?_Ethernet#3 C?=C?_Ethernet#11 C?=C?_Ethernet#10 C?=C?_Ethernet#15 C?=C?_Ethernet#14 C?=C?_Ethernet#18 C?=C?_Ethernet#17 C?=C?_Ethernet#12 C?=C?_Ethernet#16 C?=C?_Ethernet#13 CN2=CN2_Ethernet DD?=DD?_Ethernet L2=L2_Ethernet L?=L?_Ethernet R59=R59_Ethernet R60=R60_Ethernet R61=R61_Ethernet R62=R62_Ethernet R63=R63_Ethernet R64=R64_Ethernet R65=R65_Ethernet R66=R66_Ethernet R67=R67_Ethernet R68=R68_Ethernet R69=R69_Ethernet R70=R70_Ethernet R71=R71_Ethernet R72=R72_Ethernet R73=R73_Ethernet R74=R74_Ethernet R75=R75_Ethernet R76=R76_Ethernet R77=R77_Ethernet R78=R78_Ethernet R79=R79_Ethernet R80=R80_Ethernet R81=R81_Ethernet R?=R?_Ethernet#31 R?=R?_Ethernet#30 R?=R?_Ethernet#33 R?=R?_Ethernet#36 R?=R?_Ethernet#37 R?=R?_Ethernet#34 R?=R?_Ethernet#35 R?=R?_Ethernet#21 R?=R?_Ethernet#23 R?=R?_Ethernet#18 R?=R?_Ethernet#15 R?=R?_Ethernet#12 R?=R?_Ethernet#11 R?=R?_Ethernet#9 R?=R?_Ethernet#2 R?=R?_Ethernet#13 R?=R?_Ethernet#16 R?=R?_Ethernet#19 R?=R?_Ethernet#20 R?=R?_Ethernet#22 R?=R?_Ethernet#24 R?=R?_Ethernet#25 R?=R?_Ethernet#1 R?=R?_Ethernet#8 R?=R?_Ethernet#10 R?=R?_Ethernet#28 R?=R?_Ethernet#27 R?=R?_Ethernet#29 R?=R?_Ethernet#32 R?=R?_Ethernet#14 R?=R?_Ethernet#26 R?=R?_Ethernet#17 R?=R?_Ethernet#3 R?=R?_Ethernet#4 R?=R?_Ethernet#7 R?=R?_Ethernet#5 R?=R?_Ethernet#6 SB4=SB4_Ethernet SB5=SB5_Ethernet SB6=SB6_Ethernet U10=U10_Ethernet U11=U11_Ethernet U12=U12_Ethernet U?=U?_Ethernet#1 U?=U?_Ethernet#2 X2=X2_Ethernet Y1=Y1_Ethernet; ports Gen_25MHz=Gen_25MHz LED0=NetDD?_35 LED2=NetDD?_37 MDC=NetDD?_14 MDIO=NetDD?_15 NRST=NetSB4_Ethernet_1 PHY_INT=NetDD?_34 PHY_RST=NetC?#13_1 RGMII_CRS_DV=NetR?#10_2 RGMII_RX_CLK=NetR?#13_2 RGMII_RXD0=NetR?#7_2 RGMII_RXD1=NetR?#6_2 RGMII_RXD2=NetR?#4_2 RGMII_RXD3=NetR?#2_2 RGMII_TX_CLK=NetDD?_21 RGMII_TX_EN=NetDD?_20 RGMII_TXD0=NetDD?_19 RGMII_TXD1=NetDD?_18 RGMII_TXD2=NetDD?_17 RGMII_TXD3=NetDD?_16 RMII_CRS_DV=NetR76_Ethernet_1 RMII_MDC=NetU12_Ethernet_13 RMII_MDIO=NetR62_Ethernet_1 RMII_REF_CLK=NetR77_Ethernet_1 RMII_RXD0=NetR68_Ethernet_1 RMII_RXD1=NetR69_Ethernet_1 RMII_TX_EN=NetU12_Ethernet_16 RMII_TXD0=NetU12_Ethernet_17 RMII_TXD1=NetU12_Ethernet_18
Designator/USB: designators C23=C23_USB C24=C24_USB C25=C25_USB C26=C26_USB C27=C27_USB C28=C28_USB C29=C29_USB C30=C30_USB C31=C31_USB C32=C32_USB C33=C33_USB C34=C34_USB C35=C35_USB C36=C36_USB C37=C37_USB C?=C?_USB#1 C?=C?_USB#4 C?=C?_USB#9 C?=C?_USB#6 C?=C?_USB#7 C?=C?_USB#8 C?=C?_USB#5 C?=C?_USB#2 C?=C?_USB#3 C?=C?_USB#11 C?=C?_USB#10 C?=C?_USB#15 C?=C?_USB#14 C?=C?_USB#18 C?=C?_USB#17 C?=C?_USB#12 C?=C?_USB#16 C?=C?_USB#13 CN2=CN2_USB DD?=DD?_USB L2=L2_USB L?=L?_USB R59=R59_USB R60=R60_USB R61=R61_USB R62=R62_USB R63=R63_USB R64=R64_USB R65=R65_USB R66=R66_USB R67=R67_USB R68=R68_USB R69=R69_USB R70=R70_USB R71=R71_USB R72=R72_USB R73=R73_USB R74=R74_USB R75=R75_USB R76=R76_USB R77=R77_USB R78=R78_USB R79=R79_USB R80=R80_USB R81=R81_USB R?=R?_USB#31 R?=R?_USB#30 R?=R?_USB#33 R?=R?_USB#36 R?=R?_USB#37 R?=R?_USB#34 R?=R?_USB#35 R?=R?_USB#21 R?=R?_USB#23 R?=R?_USB#18 R?=R?_USB#15 R?=R?_USB#12 R?=R?_USB#11 R?=R?_USB#9 R?=R?_USB#2 R?=R?_USB#13 R?=R?_USB#16 R?=R?_USB#19 R?=R?_USB#20 R?=R?_USB#22 R?=R?_USB#24 R?=R?_USB#25 R?=R?_USB#1 R?=R?_USB#8 R?=R?_USB#10 R?=R?_USB#28 R?=R?_USB#27 R?=R?_USB#29 R?=R?_USB#32 R?=R?_USB#14 R?=R?_USB#26 R?=R?_USB#17 R?=R?_USB#3 R?=R?_USB#4 R?=R?_USB#7 R?=R?_USB#5 R?=R?_USB#6 SB4=SB4_USB SB5=SB5_USB SB6=SB6_USB U10=U10_USB U11=U11_USB U12=U12_USB U?=U?_USB#1 U?=U?_USB#2 X2=X2_USB Y1=Y1_USB; ports Gen_25MHz=Gen_25MHz LED0=NetDD?_35 LED2=NetDD?_37 MDC=NetDD?_14 MDIO=NetDD?_15 NRST=NetSB4_Ethernet_1 PHY_INT=NetDD?_34 PHY_RST=NetC?#13_1 RGMII_CRS_DV=NetR?#10_2 RGMII_RX_CLK=NetR?#13_2 RGMII_RXD0=NetR?#7_2 RGMII_RXD1=NetR?#6_2 RGMII_RXD2=NetR?#4_2 RGMII_RXD3=NetR?#2_2 RGMII_TX_CLK=NetDD?_21 RGMII_TX_EN=NetDD?_20 RGMII_TXD0=NetDD?_19 RGMII_TXD1=NetDD?_18 RGMII_TXD2=NetDD?_17 RGMII_TXD3=NetDD?_16 RMII_CRS_DV=NetR76_Ethernet_1 RMII_MDC=NetU12_Ethernet_13 RMII_MDIO=NetR62_Ethernet_1 RMII_REF_CLK=NetR77_Ethernet_1 RMII_RXD0=NetR68_Ethernet_1 RMII_RXD1=NetR69_Ethernet_1 RMII_TX_EN=NetU12_Ethernet_16 RMII_TXD0=NetU12_Ethernet_17 RMII_TXD1=NetU12_Ethernet_18

### Layout directives
differential pair: RD_N_Ethernet, RD_P_Ethernet, RX_N_Ethernet, RX_P_Ethernet, TD_N_Ethernet, TD_P_Ethernet, TX_N_Ethernet, TX_P_Ethernet
differential pair; net class DIFF100: (no net found under the mark)
net class SE50: (no net found under the mark)

### Notes on the sheet
- Total power at sheet:
  24V - 1A
  5V - 1A
- ETHERNET
- PG11
- PG13
- PB13
- PC4
- PC5
- PA7
- PC1
- PA2
- (near R77) PA1
- 3.3V@430mW
- CFG_MODE:
  UTP <-> RGMII
- 2ns delay to RXC
- PhyAddress = 000
- Настроить в регистре 16
  LED0 - Link 10/100/1000+Active
  LED2 - Link1000
- V_RGMII = 3.3V
- (near R?#31) 300mA
- Сброс проводить импульсом 10мс
- Title
- Size:
- Date:
- File:
- A2
- Number:
- Time:
- Revision:
- Sheet
- of

### Library data of the parts
C23 C24 C26 C29-C31 = MCD-00237: Capacitor, MLCC, 100nF, 6V3, X5R, 10%, 0603, T=0,8mm; Manufacturer_Part_Number: CC0603KRX5R5BB104; Manufacturer: YAGEO; Provided_By: SUBCO; ECCN_US: EAR99; ECCN_EU: NEC; Internal_Part_Number: MCD-00237; Status: Released; Part_Type: Capacitor; Package: C0603; ComponentLink1Description: Datasheet; ComponentLink1URL: http://tunmcdsvn.tun.st.com/Component_Datasheet_Library/Trunk/Capacitors/Yageo_Multilayer_capacitor_X5R_series_100pF_to_100uF
C25 = MCD-01124: Capacitor, MLCC, 10µF, 10V, X5R, 10%, 0603, T=0.8mm; Manufacturer_Part_Number: GRM188R61A106KAAL; Manufacturer: MURATA; Provided_By: SUBCO; ECCN_US: EAR99; ECCN_EU: NEC; Internal_Part_Number: MCD-01124; Status: Released; Part_Type: Capacitor; Package: C0603; ComponentLink1Description: Datasheet; ComponentLink1URL: http://tunmcdsvn.tun.st.com/Component_Datasheet_Library/Trunk/Capacitors/Murata_Capacitor_GR_series
C27 = MCD-00724: Capacitor, MLCC, 470pF, 50V, NPO, 5%, 0402, T=0,5mm; Manufacturer_Part_Number: CC0402JRNPO9BN471; Manufacturer: YAGEO; Provided_By: SUBCO; Internal_Part_Number: MCD-00724; Status: Released; Part_Type: Capacitor; Package: C0402; ComponentLink1Description: Datasheet; ComponentLink1URL: http://tunmcdsvn.tun.st.com/Component_Datasheet_Library/Trunk/Capacitors/Yageo_Capacitor_NP0_16V-to-50V; ECCN_US: N/A; ECCN_EU: N/A
C28 = MCD-00095: Capacitor, MLCC, 1uF, 6V3, X5R, 10%, 0402, T=0,5mm; Manufacturer_Part_Number: GRM155R61E105KA12; Manufacturer: MURATA; Alternate_Manufacturer_Part_Number: GRM155R60J105KE19; Provided_By: SUBCO; ECCN_US: EAR99; ECCN_EU: NEC; Internal_Part_Number: MCD-00095; Status: Released; Part_Type: Capacitor; Package: C0402; ComponentLink1Description: Datasheet; ComponentLink1URL: http://tunmcdsvn.tun.st.com/Component_Datasheet_Library/Trunk/Capacitors/Murata_Capacitor_GR_series; Alternate_Manufacturer: MURATA
C32 = MCD-00722: Capacitor, MLCC, 1nF, 2KV, X7R, 10%, 1206, T=1,25mm; Manufacturer_Part_Number: CC1206KKX7RDBB102; Manufacturer: YAGEO; Provided_By: SUBCO; Internal_Part_Number: MCD-00722; Status: Released; Part_Type: Capacitor; Package: C1206; ComponentLink1Description: Datasheet; ComponentLink1URL: http://tunmcdsvn.tun.st.com/Component_Datasheet_Library/Trunk/Capacitors/Yageo_Multilayer_Capacitor_NPO_X7R_1KV_to_3KV_10pF_to_33nF/; ECCN_US: N/A; ECCN_EU: N/A
C33 C34 = MCD-01374: Capacitor, MLCC, 5.6pF, 50V, NPO, 5%, 0402, T=0,5mm; Manufacturer_Part_Number: CC0402BRNPO9BN5R6; Manufacturer: YAGEO; Provided_By: SUBCO; Internal_Part_Number: MCD-01374; Status: Released; Part_Type: Capacitor; Package: C0402; ComponentLink1Description: Datasheet; ComponentLink1URL: http://tunmcdsvn.tun.st.com/Component_Datasheet_Library/Trunk/Capacitors/Yageo_Capacitor_NP0_16V-to-50V; ECCN_US: N/A; ECCN_EU: N/A
C35-C37 = Capacitor_1: Capacitor, MLCC, 100nF, 6V3, X5R, 10%, 0603, T=0,8mm; Internal_Part_Number: MCD-00237; Manufacturer_Part_Number: CC0603KRX5R5BB104; Manufacturer: YAGEO; Provided_By: SUBCO; ECCN_US: EAR99; ECCN_EU: NEC; Status: Released; Part_Type: Capacitor; Package: C0603; ComponentLink1Description: Datasheet; ComponentLink1URL: http://tunmcdsvn.tun.st.com/Component_Datasheet_Library/Trunk/Capacitors/Yageo_Multilayer_capacitor_X5R_series_100pF_to_100uF
C?#1 = C0805: Chip Capacitor (MLCC), 0805, Umax=200V, SIZE=2.0x1.3x1.3mm, SMT; Value: C0805-16В-4,7мкФ-10%-X7R (CCTC, TCC0805X7R475K160FT)
C?#2-C?#4 C?#6-C?#10 C?#12-C?#14 C?#16 C?#17 = C0402: Value: C0402-16В-0,1мкФ-10%-X7R (CCTC, TCC0402X7R104K160AT)
C?#5 C?#11 C?#15 C?#18 = C0603: Chip Capacitor (MLCC), 0603, Umax=100V, SIZE=1.6x0.8x0.9mm, SMT; Value: C0603-25В-1,0мкФ-10%-X7R (CCTC, TCC0603X7R105K250CT); Currency: *; Distributor: *; PartNumber: *; HelpURL: *; Manufacturer: *; Volume1: *; Price1: *
CN2 = MCD-00717: RJ45 jack, single port, with LEDS, Metal shielded dip low profile; Part_Type: Connector; Manufacturer: DONGGUAN KEYOUDA ELECTRONIC TECHNOLOGY; Provided_By: SUBCO; Internal_Part_Number: MCD-00717; Status: Released; Manufacturer_Part_Number: KRJ-CB4.2GYZNL; ComponentLink1Description: Datasheet; ComponentLink1URL: http://tunmcdsvn.tun.st.com/Component_Datasheet_Library/Trunk/Connectors/DGKYD_RJ45_KRJ-CB4.2GYZNL; ECCN_US: n/a; ECCN_EU: n/a
DD? U?#1 = RTL8211: Integrated 10/100/1000M Ethernet precision  transceiver. Provides physical layer functions.; Value: RTL8211FSI-VS-CG (REALTEK, QFN-48)
L2 = MCD-00047: SMD Chip ferrite bead, 600R@100MHz +/-25%, 350mA, 500mohm DC, 0603, T=0.8mm; Part_Type: Inductor; Manufacturer_Part_Number: FCM1608KF-601T03; Manufacturer: TAI-TECH; Provided_By: SUBCO; Internal_Part_Number: MCD-00047; Status: Released; ComponentLink1Description: Datasheet; ComponentLink1URL: http://tunmcdsvn.tun.st.com/Component_Datasheet_Library/Trunk/Inductors/TaiTech_Bead_FCM1608_series; ECCN_US: n/a; ECCN_EU: n/a
L? = L1210: Fixed Inductor L1210, SIZE=3.2x2.5x1.2mm; Value: L1210-2,2мкГн-20%-3,6А-75мОм (3Lcoils, LHP322512-2R2M)
R59-R61 R63 R70 R79 R?#3-R?#5 R?#7 = MCD-00053: Resistor,10K,0402,1%,1/16W; Manufacturer_Part_Number: RC0402FR-0710KL; Manufacturer: YAGEO; Provided_By: SUBCO; ECCN_US: EAR99; ECCN_EU: NEC; Internal_Part_Number: MCD-00053; Status: Released; Part_Type: Resistor; Package: R0402; ComponentLink1Description: Datasheet; ComponentLink1URL: http://tunmcdsvn.tun.st.com/Component_Datasheet_Library/Trunk/Resistors/Yageo_Resistor_RC0402-series
R62 R?#6 = MCD-00068: Resistor,1K5,0402,1%,1/16W; Manufacturer_Part_Number: RC0402FR-071K5L; Manufacturer: YAGEO; Provided_By: SUBCO; ECCN_US: EAR99; ECCN_EU: NEC; Internal_Part_Number: MCD-00068; Status: Released; Part_Type: Resistor; Package: R0402; ComponentLink1Description: Datasheet; ComponentLink1URL: http://tunmcdsvn.tun.st.com/Component_Datasheet_Library/Trunk/Resistors/Yageo_Resistor_RC0402-series
R64-R67 = MCD-00565: Resistor,49R9,0402,1%,1/16W; Manufacturer_Part_Number: RC0402FR-0749R9L; Manufacturer: YAGEO; Provided_By: SUBCO; ECCN_US: EAR99; ECCN_EU: NEC; Internal_Part_Number: MCD-00565; Status: Released; Part_Type: Resistor; Package: R0402; ComponentLink1Description: Datasheet; ComponentLink1URL: http://tunmcdsvn.tun.st.com/Component_Datasheet_Library/Trunk/Resistors/Yageo_Resistor_RC0402-series
R68 R69 R76 R77 = MCD-00455: Resistor,33R,0402,1%,1/16W; Manufacturer_Part_Number: RC0402FR-0733RL; Manufacturer: YAGEO; Provided_By: SUBCO; ECCN_US: EAR99; ECCN_EU: NEC; Internal_Part_Number: MCD-00455; Status: Released; Part_Type: Resistor; Package: R0402; ComponentLink1Description: Datasheet; ComponentLink1URL: http://tunmcdsvn.tun.st.com/Component_Datasheet_Library/Trunk/Resistors/Yageo_Resistor_RC0402-series
R71-R74 = MCD-00515: Resistor,75R,0402,1%,1/16W; Manufacturer_Part_Number: RC0402FR-0775RL; Manufacturer: YAGEO; Provided_By: SUBCO; ECCN_US: EAR99; ECCN_EU: NEC; Internal_Part_Number: MCD-00515; Status: Released; Part_Type: Resistor; Package: R0402; ComponentLink1Description: Datasheet; ComponentLink1URL: http://tunmcdsvn.tun.st.com/Component_Datasheet_Library/Trunk/Resistors/Yageo_Resistor_RC0402-series
R75 = MCD-00723: Resistor,12K1,0402,1%,1/16W; Manufacturer_Part_Number: RC0402FR-0712K1L; Manufacturer: YAGEO; Provided_By: SUBCO; ECCN_US: EAR99; ECCN_EU: NEC; Internal_Part_Number: MCD-00723; Status: Released; Part_Type: Resistor; Package: R0402; ComponentLink1Description: Datasheet; ComponentLink1URL: http://tunmcdsvn.tun.st.com/Component_Datasheet_Library/Trunk/Resistors/Yageo_Resistor_RC0402-series
R78 R80 = MCD-00441: Resistor,270R,0402,1%,1/16W; Manufacturer_Part_Number: RC0402FR-07270RL; Manufacturer: YAGEO; Provided_By: SUBCO; ECCN_US: EAR99; ECCN_EU: NEC; Internal_Part_Number: MCD-00441; Status: Released; Part_Type: Resistor; Package: R0402; ComponentLink1Description: Datasheet; ComponentLink1URL: http://tunmcdsvn.tun.st.com/Component_Datasheet_Library/Trunk/Resistors/Yageo_Resistor_RC0402-series
R81 = MCD-00052: Resistor,0R,0402,5%,1/16W; Manufacturer_Part_Number: RC0402JR-070RL; Manufacturer: YAGEO; Provided_By: SUBCO; ECCN_US: EAR99; ECCN_EU: NEC; Internal_Part_Number: MCD-00052; Status: Released; Part_Type: Resistor; Package: R0402; ComponentLink1Description: Datasheet; ComponentLink1URL: http://tunmcdsvn.tun.st.com/Component_Datasheet_Library/Trunk/Resistors/Yageo_Resistor_RC0402-series
R?#1 R?#2 R?#8-R?#33 R?#35-R?#37 = R0402
  R?#2 R?#9 R?#11 R?#12 R?#15 R?#18: Value: RC02-22 Ом-1%
  R?#13 R?#16 R?#19 R?#20 R?#22 R?#24 R?#27 R?#30 R?#31 R?#33 R?#36: Value: RC02-0,0 Ом 5%
  R?#21 R?#23 R?#28: Value: RC02-2,0кОм 5%
  R?#25 R?#26 R?#35: Value: RC02-4,7кОм 5%
R?#34 = RC03: Chip Resistor, 0603, Pmax=0.100W, Umax=50V, SIZE=1.6x0.9x0.5mm, SMT; Value: RC03-2,49кОм 1% (Walsin, WR06X2491FTL); Currency: *; Distributor: *; PartNumber: *; HelpURL: *; Manufacturer: *; Volume1: *; Price1: *
SB4-SB6 = MCD-00071: Solder Bridge ON; Part_Type: Mechanical; Manufacturer_Part_Number: RC0603JR-070RL; Manufacturer: YAGEO; Provided_By: SUBCO; Internal_Part_Number: MCD-00071; Status: Released; ComponentLink1Description: Datasheet; Package: SB0603; ComponentLink1URL: http://tunmcdsvn.tun.st.com/Component_Datasheet_Library/Trunk/Resistors/Yageo_Resistor_RC0603-series; ECCN_US: n/a; ECCN_EU: n/a
U10 = MCD-00250: Very low capacitance ESD protection , 4 lines; Part_Type: IC; Manufacturer: STMICROELECTRONICS; BMS_Part_Number: 9151001; Provided_By: SUBCO with ST control; ECCN_US: EAR99; ECCN_EU: NEC; Internal_Part_Number: MCD-00250; Value: USBLC6-4SC6; Status: Released; Manufacturer_Part_Number: USBLC6-4SC6; ComponentLink1Description: Datasheet; ComponentLink1URL: http://tunmcdsvn.tun.st.com/Component_Datasheet_Library/Trunk/Diodes/STM_ESD_USBLC6-4SC6
U11 = MCD-00718: Discrete Magnetic Transformer Module, 16 pins, SMT, 100 Base-TX; Part_Type: IC; Manufacturer: DONGGUAN KEYOUDA ELECTRONIC TECHNOLOGY; Provided_By: SUBCO; Internal_Part_Number: MCD-00718; Value: KMS-1102NL; Status: Released; Manufacturer_Part_Number: KMS-1102NL; ComponentLink1Description: Datasheet; ComponentLink1URL: http://tunmcdsvn.tun.st.com/Component_Datasheet_Library/Trunk/IC/DGKYD_KMS-1102NL; ECCN_US: n/a; ECCN_EU: n/a
U12 = MCD-00719: 10/100M RMII Ethernet transceiver; Part_Type: IC; Manufacturer: MICROCHIP; Provided_By: SUBCO; Internal_Part_Number: MCD-00719; Value: LAN8742A-CZ-TR; Status: Released; Manufacturer_Part_Number: LAN8742A-CZ-TR; ComponentLink1Description: Datasheet; ComponentLink1URL: http://tunmcdsvn.tun.st.com/Component_Datasheet_Library/Trunk/IC/MICROCHIP_LAN8742A_RMII_PHY; ECCN_US: n/a; ECCN_EU: n/a
U?#2 = RK3568: Rockchip RK3568 Quad-core Cortex-A55, 2.0GHz; Manufacturer: TE Connectivity; Manufacturer Part Number: 1717254-4; Connector Type: Receptacle; Number of Positions: 200; Number of Positions Loaded: All; Pitch: 0.100" (2.54mm); .Creator: MM; Supplier 1: Digi-Key; RoHS: RoHS Compliant; Category: Connectors, Interconnects; Stock 1: 51; Pricing 1: 1=7.42, 10=6.864, 50=6.1586, 100=5.7505, 250=5.00852, 500=4.823, 1000=4.6375, 2500=4.452 (USD); Packaging: Tape & Reel; Contact Type: Female Socket; Number of Rows: 2; Row Spacing: 0.100" (2.54mm); Mounting Type: Through Hole; Termination: Solder; Fastening Type: -; Features: -; Contact Finish: Gold; Contact Finish Thickness: 20µin (0.51µm); Color: Black; ComponentLink1URL: https://wiki.inmys.ru/doku.php?id=wiki:cmp:proc:rockchip-rk3568:start; ComponentLink1Description: DataSheet; Supplier Part Number 1: SAM8767-ND; .Checked PCB: MM; .Checked SCH: MM; Value: *
X2 = MCD-01364: Crystal 25MHz, 6pF, +-20ppm, 80ohms max, SMD; Part_Type: Crystal_Osc; Manufacturer_Part_Number: NX2016SA 25MHz EXS00A-CS11321; Manufacturer: NDK; BMS_Part_Number: 9157044; Provided_By: SUBCO; ECCN_US: EAR99; ECCN_EU: NEC; Internal_Part_Number: MCD-01364; Status: Released; Package: NX2016SA; ComponentLink1Description: Datasheet; ComponentLink1URL: http://tunmcdsvn.tun.st.com/Component_Datasheet_Library/Trunk/Crystal_Osc/NDK_NX2016SA 25MHz EXS00A-CS11321 (EXS10B-28187); Order_Code_Digikey: 644-1367
Y1 = ABM8G-25.000MHZ-18-D2Y-T: CRYSTAL 25MHZ 18PF SMD; Manufacturer: Abracon Corporation; Frequency Stability: ±30ppm; Frequency Tolerance: ±20ppm; ESR (Equivalent Series Resistance): 60 Ohm; Operating Mode: Fundamental; .Checked PCB: MM; Supplier 1: Digi-Key; Manufacturer Part Number: ABM8G-25.000MHZ-18-D2Y-T; RoHS: RoHS Compliant; Category: Crystals and Oscillators; Stock 1: 25549; Pricing 1: 1=1.06, 10=0.944, 50=0.8814, 100=0.78, 500=0.7371 (USD); Packaging: Cut Tape (CT); Type: MHz Crystal; Frequency: 25MHz; Load Capacitance: 18pF; Operating Temperature: -40°C ~ 85°C; Ratings: -; Mounting Type: Surface Mount; Package / Case: 4-SMD, No Lead (DFN, LCC); Size / Dimension: 0.126" L x 0.098" W (3.20mm x 2.50mm); Height: 0.039" (1.00mm); ComponentLink1URL: http://www.abracon.com/Resonators/ABM8G.pdf; ComponentLink1Description: http://www.abracon.com/Resonators/ABM8G.pdf; Supplier Part Number 1: 535-10275-1-ND; .Checked SCH: MM; .Creator: MM

## Sheet RK3568-SOM-PWR.SchDoc: Ethernet PHY with RJ45 connector
size A2; Date: Not used; ApprovedBy: Not used; CheckedBy: Not used; Author: Not used; CompanyName: STMicroelectronics; DrawnBy: Not used; Engineer: Not used; Organization: Not used; Address1: Not used; Address2: Not used; Address3: Not used; Address4: Not used; DocumentNumber: 6; Revision: Not used; SheetNumber: 6; SheetTotal: 9; Time: Not used; ImagePath: Not used; Application_BuildNumber: Not used
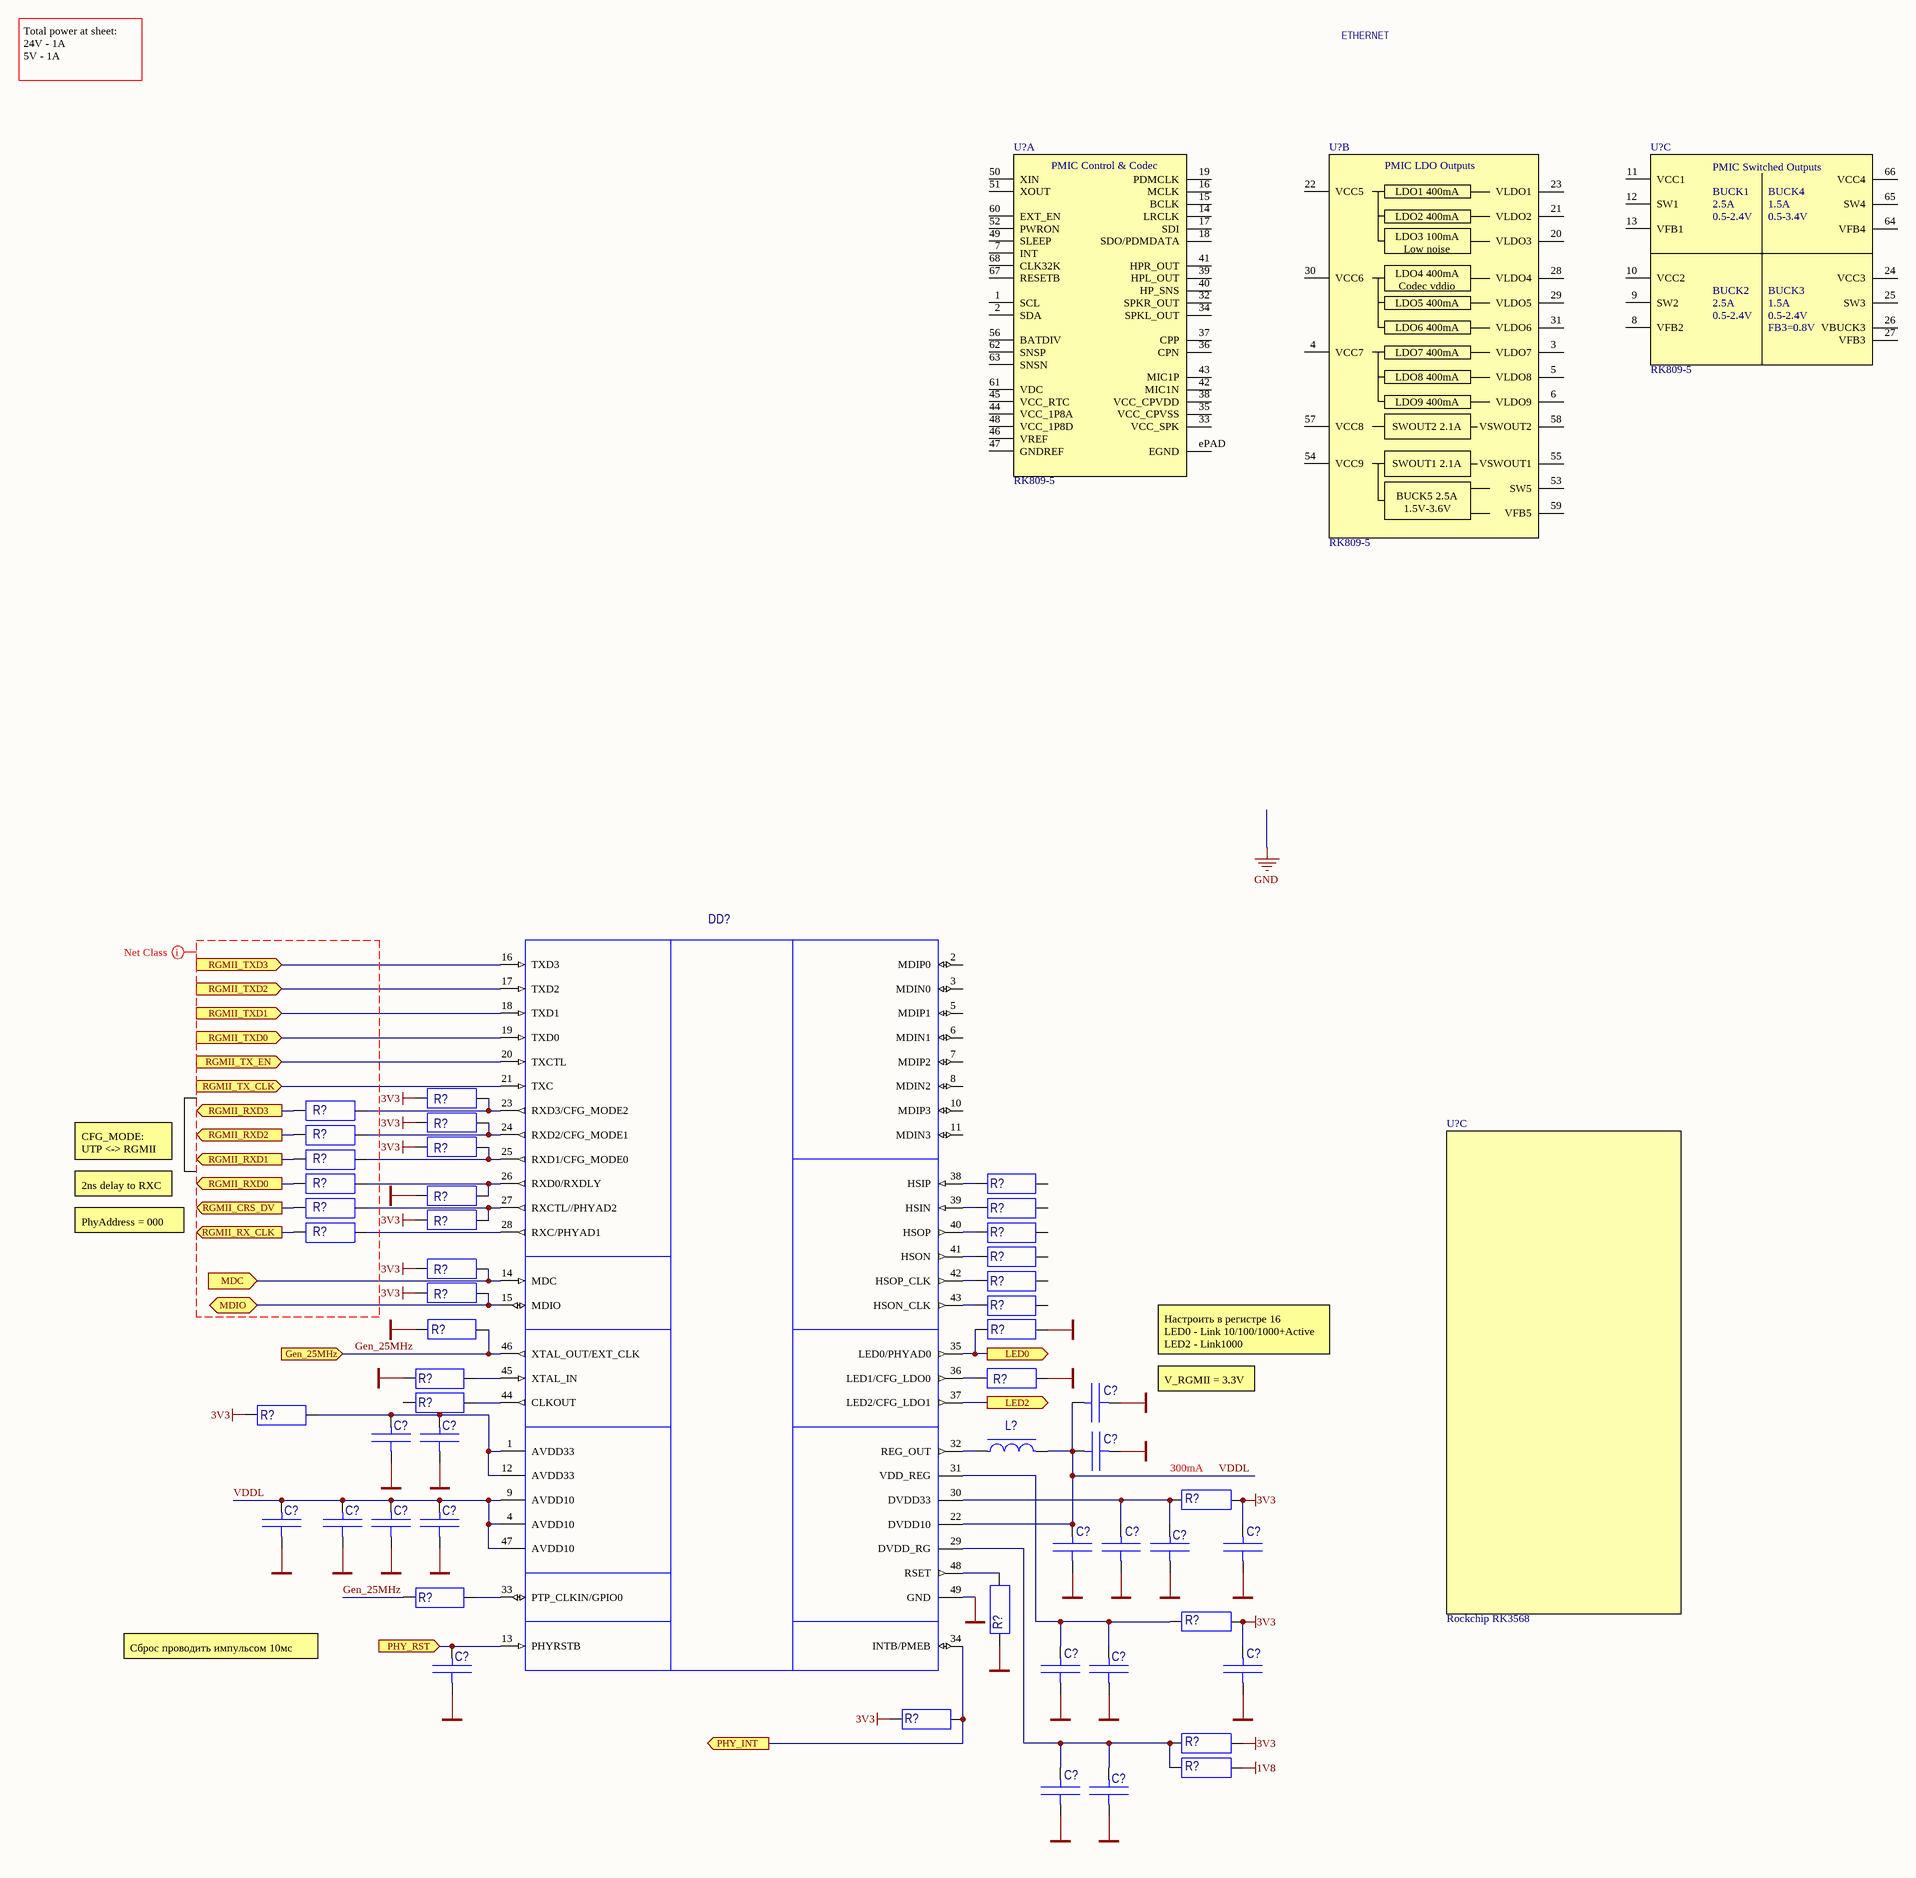
[diagram p5: RK3568-SOM-PWR.SchDoc]

### Parts
(Parts that share a designator on the sheet are numbered #1, #2 ... from top to bottom, then left to right.)
C?#1  C0805-16В-4,7мкФ-10%-X7R (CCTC, TCC0805X7R475K160FT)  [CC0805-KL]  (value not drawn)
C?#2  C0402-16В-0,1мкФ-10%-X7R (CCTC, TCC0402X7R104K160AT)  [C0402]  (value not drawn)
C?#3  C0402-16В-0,1мкФ-10%-X7R (CCTC, TCC0402X7R104K160AT)  [C0402]  (value not drawn)
C?#4  C0402-16В-0,1мкФ-10%-X7R (CCTC, TCC0402X7R104K160AT)  [C0402]  (value not drawn)
C?#5  C0603-25В-1,0мкФ-10%-X7R (CCTC, TCC0603X7R105K250CT)  [CC0603-KL]  (value not drawn)
C?#6  C0402-16В-0,1мкФ-10%-X7R (CCTC, TCC0402X7R104K160AT)  [C0402]  (value not drawn)
C?#7  C0402-16В-0,1мкФ-10%-X7R (CCTC, TCC0402X7R104K160AT)  [C0402]  (value not drawn)
C?#8  C0402-16В-0,1мкФ-10%-X7R (CCTC, TCC0402X7R104K160AT)  [C0402]  (value not drawn)
C?#9  C0402-16В-0,1мкФ-10%-X7R (CCTC, TCC0402X7R104K160AT)  [C0402]  (value not drawn)
C?#10  C0402-16В-0,1мкФ-10%-X7R (CCTC, TCC0402X7R104K160AT)  [C0402]  (value not drawn)
C?#11  C0603-25В-1,0мкФ-10%-X7R (CCTC, TCC0603X7R105K250CT)  [CC0603-KL]  (value not drawn)
C?#12  C0402-16В-0,1мкФ-10%-X7R (CCTC, TCC0402X7R104K160AT)  [C0402]  (value not drawn)
C?#13  C0402-16В-0,1мкФ-10%-X7R (CCTC, TCC0402X7R104K160AT)  [C0402]  (value not drawn)
C?#14  C0402-16В-0,1мкФ-10%-X7R (CCTC, TCC0402X7R104K160AT)  [C0402]  (value not drawn)
C?#15  C0603-25В-1,0мкФ-10%-X7R (CCTC, TCC0603X7R105K250CT)  [CC0603-KL]  (value not drawn)
C?#16  C0402-16В-0,1мкФ-10%-X7R (CCTC, TCC0402X7R104K160AT)  [C0402]  (value not drawn)
C?#17  C0402-16В-0,1мкФ-10%-X7R (CCTC, TCC0402X7R104K160AT)  [C0402]  (value not drawn)
C?#18  C0603-25В-1,0мкФ-10%-X7R (CCTC, TCC0603X7R105K250CT)  [CC0603-KL]  (value not drawn)
DD?  RTL8211FSI-VS-CG (REALTEK, QFN-48)  [QFN40P600X600X100-with_vias]  (value not drawn)
L?  L1210-2,2мкГн-20%-3,6А-75мОм (3Lcoils, LHP322512-2R2M)  [IND3225X135]  (value not drawn)
R?#1  (no value)  [R0402]
R?#2  RC02-22 Ом-1%  [R0402]  (value not drawn)
R?#3  (no value)  [R0402]
R?#4  RC02-22 Ом-1%  [R0402]  (value not drawn)
R?#5  (no value)  [R0402]
R?#6  RC02-22 Ом-1%  [R0402]  (value not drawn)
R?#7  RC02-22 Ом-1%  [R0402]  (value not drawn)
R?#8  RC02-0,0 Ом 5%  [R0402]  (value not drawn)
R?#9  (no value)  [R0402]
R?#10  RC02-22 Ом-1%  [R0402]  (value not drawn)
R?#11  RC02-0,0 Ом 5%  [R0402]  (value not drawn)
R?#12  (no value)  [R0402]
R?#13  RC02-22 Ом-1%  [R0402]  (value not drawn)
R?#14  RC02-0,0 Ом 5%  [R0402]  (value not drawn)
R?#15  RC02-0,0 Ом 5%  [R0402]  (value not drawn)
R?#16  RC02-2,0кОм 5%  [R0402]  (value not drawn)
R?#17  RC02-0,0 Ом 5%  [R0402]  (value not drawn)
R?#18  RC02-2,0кОм 5%  [R0402]  (value not drawn)
R?#19  RC02-0,0 Ом 5%  [R0402]  (value not drawn)
R?#20  RC02-4,7кОм 5%  [R0402]  (value not drawn)
R?#21  RC02-4,7кОм 5%  [R0402]  (value not drawn)
R?#22  RC02-0,0 Ом 5%  [R0402]  (value not drawn)
R?#23  RC02-2,0кОм 5%  [R0402]  (value not drawn)
R?#24  (no value)  [R0402]
R?#25  RC02-0,0 Ом 5%  [R0402]  (value not drawn)
R?#26  RC02-0,0 Ом 5%  [R0402]  (value not drawn)
R?#27  (no value)  [R0402]
R?#28  RC02-0,0 Ом 5%  [R0402]  (value not drawn)
R?#29  RC03-2,49кОм 1% (Walsin, WR06X2491FTL)  [RC0603-KL]  (value not drawn)
R?#30  RC02-4,7кОм 5%  [R0402]  (value not drawn)
R?#31  RC02-0,0 Ом 5%  [R0402]  (value not drawn)
R?#32  (no value)  [R0402]
U?#1  *  [QFN40P600X600X100-with_vias]  (value not drawn)  (part C of 3)
U?#2  *  [QFN40P600X600X100-with_vias]  (value not drawn)  (part A of 3)
U?#3  *  [QFN40P600X600X100-with_vias]  (value not drawn)  (part B of 3)
U?#4  PartNumber: Rockchip RK3568  [ESQ-120-14-G-D]  (hidden comment: *)  (part C of 6)

### Ports
Gen_25MHz (in), LED0 (out), LED2 (out), MDC (in), MDIO (bidir), PHY_INT (out), PHY_RST (in), RGMII_CRS_DV (out), RGMII_RX_CLK (out), RGMII_RXD0 (out), RGMII_RXD1 (out), RGMII_RXD2 (out), RGMII_RXD3 (out), RGMII_TX_CLK (in), RGMII_TX_EN (in), RGMII_TXD0 (in), RGMII_TXD1 (in), RGMII_TXD2 (in), RGMII_TXD3 (in)

### Nets
1V8: R?#32.2
3V3: C?#12.1 C?#16.1 R?#1.1 R?#3.1 R?#5.1 R?#12.1 R?#16.1 R?#18.1 R?#25.2 R?#26.2 R?#28.2 R?#30.2 R?#31.2
GND: C?#1.2 C?#2.2 C?#3.2 C?#4.2 C?#5.2 C?#6.2 C?#7.2 C?#8.2 C?#9.2 C?#10.2 C?#11.2 C?#12.2 C?#13.2 C?#14.2 C?#15.2 C?#16.2 C?#17.2 C?#18.2 DD?.49(GND) R?#9.1 R?#20.1 R?#21.2 R?#22.2 R?#23.2 R?#29.1
Gen_25MHz: DD?.46(XTAL_OUT/EXT_CLK) R?#20.2 R?#27.2 ; port Gen_25MHz
VDDL: C?#1.1 C?#4.1 C?#5.1 C?#6.1 C?#7.1 C?#8.1 C?#9.1 DD?.4(AVDD10) DD?.9(AVDD10) DD?.22(DVDD10) DD?.47(AVDD10) L?.2
NetC?#2_1: C?#2.1 C?#3.1 DD?.1(AVDD33) DD?.12(AVDD33) R?#25.1
NetC?#10_1: C?#10.1 C?#11.1 DD?.30(DVDD33) R?#26.1
NetC?#13_1: C?#13.1 DD?.13(PHYRSTB) ; port PHY_RST
NetC?#14_1: C?#14.1 C?#15.1 DD?.31(VDD_REG) R?#28.1
NetC?#17_1: C?#17.1 C?#18.1 DD?.29(DVDD_RG) R?#31.1 R?#32.1
NetDD?_14: DD?.14(MDC) R?#16.2 ; port MDC
NetDD?_15: DD?.15(MDIO) R?#18.2 ; port MDIO
NetDD?_16: DD?.16(TXD3) ; port RGMII_TXD3
NetDD?_17: DD?.17(TXD2) ; port RGMII_TXD2
NetDD?_18: DD?.18(TXD1) ; port RGMII_TXD1
NetDD?_19: DD?.19(TXD0) ; port RGMII_TXD0
NetDD?_20: DD?.20(TXCTL) ; port RGMII_TX_EN
NetDD?_21: DD?.21(TXC) ; port RGMII_TX_CLK
NetDD?_23: DD?.23(RXD3/CFG_MODE2) R?#1.2 R?#2.1
NetDD?_24: DD?.24(RXD2/CFG_MODE1) R?#3.2 R?#4.1
NetDD?_25: DD?.25(RXD1/CFG_MODE0) R?#5.2 R?#6.1
NetDD?_26: DD?.26(RXD0/RXDLY) R?#7.1 R?#9.2
NetDD?_27: DD?.27(RXCTL//PHYAD2) R?#10.1 R?#12.2
NetDD?_28: DD?.28(RXC/PHYAD1) R?#13.1
NetDD?_32: DD?.32(REG_OUT) L?.1
NetDD?_33: DD?.33(PTP_CLKIN/GPIO0) R?#27.1
NetDD?_34: DD?.34(INTB/PMEB) R?#30.1 ; port PHY_INT
NetDD?_35: DD?.35(LED0/PHYAD0) R?#21.1 ; port LED0
NetDD?_36: DD?.36(LED1/CFG_LDO0) R?#23.1
NetDD?_37: DD?.37(LED2/CFG_LDO1) ; port LED2
NetDD?_38: DD?.38(HSIP) R?#8.2
NetDD?_39: DD?.39(HSIN) R?#11.2
NetDD?_40: DD?.40(HSOP) R?#14.2
NetDD?_41: DD?.41(HSON) R?#15.2
NetDD?_42: DD?.42(HSOP_CLK) R?#17.2
NetDD?_43: DD?.43(HSON_CLK) R?#19.2
NetDD?_44: DD?.44(CLKOUT) R?#24.1
NetDD?_45: DD?.45(XTAL_IN) R?#22.1
NetDD?_48: DD?.48(RSET) R?#29.2
NetR?#2_2: R?#2.2 ; port RGMII_RXD3
NetR?#4_2: R?#4.2 ; port RGMII_RXD2
NetR?#6_2: R?#6.2 ; port RGMII_RXD1
NetR?#7_2: R?#7.2 ; port RGMII_RXD0
NetR?#10_2: R?#10.2 ; port RGMII_CRS_DV
NetR?#13_2: R?#13.2 ; port RGMII_RX_CLK

Not connected (* = marked no-connect by the designer): DD? 2(MDIP0) 3(MDIN0) 5(MDIP1) 6(MDIN1) 7(MDIP2) 8(MDIN2) 10(MDIP3) 11(MDIN3); R?#8 1; R?#11 1; R?#14 1; R?#15 1; R?#17 1; R?#19 1; R?#24 2; U?#1 8(VFB2) 9(SW2) 10(VCC2) 11(VCC1) 12(SW1) 13(VFB1) 24(VCC3) 25(SW3) 26(VBUCK3) 27(VFB3) 64(VFB4) 65(SW4) 66(VCC4); U?#2 1(SCL) 2(SDA) 7(INT) 14(LRCLK) 15(BCLK) 16(MCLK) 17(SDI) 18(SDO/PDMDATA) 19(PDMCLK) 32(SPKR_OUT) 33(VCC_SPK) 34(SPKL_OUT) 35(VCC_CPVSS) 36(CPN) 37(CPP) 38(VCC_CPVDD) 39(HPL_OUT) 40(HP_SNS) 41(HPR_OUT) 42(MIC1N) 43(MIC1P) 44(VCC_1P8A) 45(VCC_RTC) 46(VREF) 47(GNDREF) 48(VCC_1P8D) 49(SLEEP) 50(XIN) 51(XOUT) 52(PWRON) 56(BATDIV) 60(EXT_EN) 61(VDC) 62(SNSP) 63(SNSN) 67(RESETB) 68(CLK32K) ePAD(EGND); U?#3 3(VLDO7) 4(VCC7) 5(VLDO8) 6(VLDO9) 20(VLDO3) 21(VLDO2) 22(VCC5) 23(VLDO1) 28(VLDO4) 29(VLDO5) 30(VCC6) 31(VLDO6) 53(SW5) 54(VCC9) 55(VSWOUT1) 57(VCC8) 58(VSWOUT2) 59(VFB5)

### Layout directives
net class SE50: (no net found under the mark)

### Notes on the sheet
- Total power at sheet:
  24V - 1A
  5V - 1A
- ETHERNET
- CFG_MODE:
  UTP <-> RGMII
- 2ns delay to RXC
- PhyAddress = 000
- Настроить в регистре 16
  LED0 - Link 10/100/1000+Active
  LED2 - Link1000
- V_RGMII = 3.3V
- (near R?#26) 300mA
- Сброс проводить импульсом 10мс
- Title
- Size:
- Date:
- File:
- A2
- Number:
- Time:
- Revision:
- Sheet
- of
- (in symbol RK809-5, part A) PMIC Control & Codec
- (in symbol RK809-5, part B) PMIC LDO Outputs; LDO1 400mA; LDO2 400mA; LDO3 100mA / Low noise; LDO4 400mA / Codec vddio; LDO5 400mA; LDO6 400mA; LDO7 400mA; LDO8 400mA; LDO9 400mA; SWOUT2 2.1A; SWOUT1 2.1A; BUCK5 2.5A / 1.5V-3.6V
- (in symbol RK809-5, part C) PMIC Switched Outputs; BUCK1; BUCK4; 2.5A; 1.5A; 0.5-2.4V; 0.5-3.4V; BUCK2; BUCK3; FB3=0.8V

### Library data of the parts
C?#1 = C0805: as C?#1 on sheet RK3568-SOM-Eth; Value: C0805-16В-4,7мкФ-10%-X7R (CCTC, TCC0805X7R475K160FT)
C?#2-C?#4 C?#6-C?#10 C?#12-C?#14 C?#16 C?#17 = C0402: Value: C0402-16В-0,1мкФ-10%-X7R (CCTC, TCC0402X7R104K160AT)
C?#5 C?#11 C?#15 C?#18 = C0603: as C?#5 on sheet RK3568-SOM-Eth; Value: C0603-25В-1,0мкФ-10%-X7R (CCTC, TCC0603X7R105K250CT); Currency: *; Distributor: *; PartNumber: *; HelpURL: *; Manufacturer: *; Volume1: *; Price1: *
DD? = RTL8211: as DD? on sheet RK3568-SOM-Eth; Value: RTL8211FSI-VS-CG (REALTEK, QFN-48)
L? = L1210: Fixed Inductor L1210, SIZE=3.2x2.5x1.2mm; Value: L1210-2,2мкГн-20%-3,6А-75мОм (3Lcoils, LHP322512-2R2M)
R?#1-R?#28 R?#30-R?#32 = R0402
  R?#2 R?#4 R?#6 R?#7 R?#10 R?#13: Value: RC02-22 Ом-1%
  R?#8 R?#11 R?#14 R?#15 R?#17 R?#19 R?#22 R?#25 R?#26 R?#28 R?#31: Value: RC02-0,0 Ом 5%
  R?#16 R?#18 R?#23: Value: RC02-2,0кОм 5%
  R?#20 R?#21 R?#30: Value: RC02-4,7кОм 5%
R?#29 = RC03: as R?#34 on sheet RK3568-SOM-Eth; Value: RC03-2,49кОм 1% (Walsin, WR06X2491FTL); Currency: *; Distributor: *; PartNumber: *; HelpURL: *; Manufacturer: *; Volume1: *; Price1: *
U?#1-U?#3 = RK809-5: PMIC for Realtek microprocessors. QFN68 (7x7); Value: *; ComponentLink1Description: DataSheet; ComponentLink1URL: https://doc.inmys.ru/open?hash=b56d315854d8f1360d0c6d279788734c; PartNumber: RK809-5
U?#4 = RK3568: as U?#2 on sheet RK3568-SOM-Eth; Supplier 1: Digi-Key; RoHS: RoHS Compliant; Category: Connectors, Interconnects; Stock 1: 51; Pricing 1: 1=7.42, 10=6.864, 50=6.1586, 100=5.7505, 250=5.00852, 500=4.823, 1000=4.6375, 2500=4.452 (USD); Packaging: Tape & Reel; Contact Type: Female Socket; Number of Rows: 2; Row Spacing: 0.100" (2.54mm); Mounting Type: Through Hole; Termination: Solder; Fastening Type: -; Features: -; Contact Finish: Gold; Contact Finish Thickness: 20µin (0.51µm); Color: Black; ComponentLink1URL: https://wiki.inmys.ru/doku.php?id=wiki:cmp:proc:rockchip-rk3568:start; ComponentLink1Description: DataSheet; Supplier Part Number 1: SAM8767-ND; .Checked PCB: MM; .Checked SCH: MM; Value: *